# Altium project MZCAT_motherboard_RPI.PrjPcb (part 1 of 2)
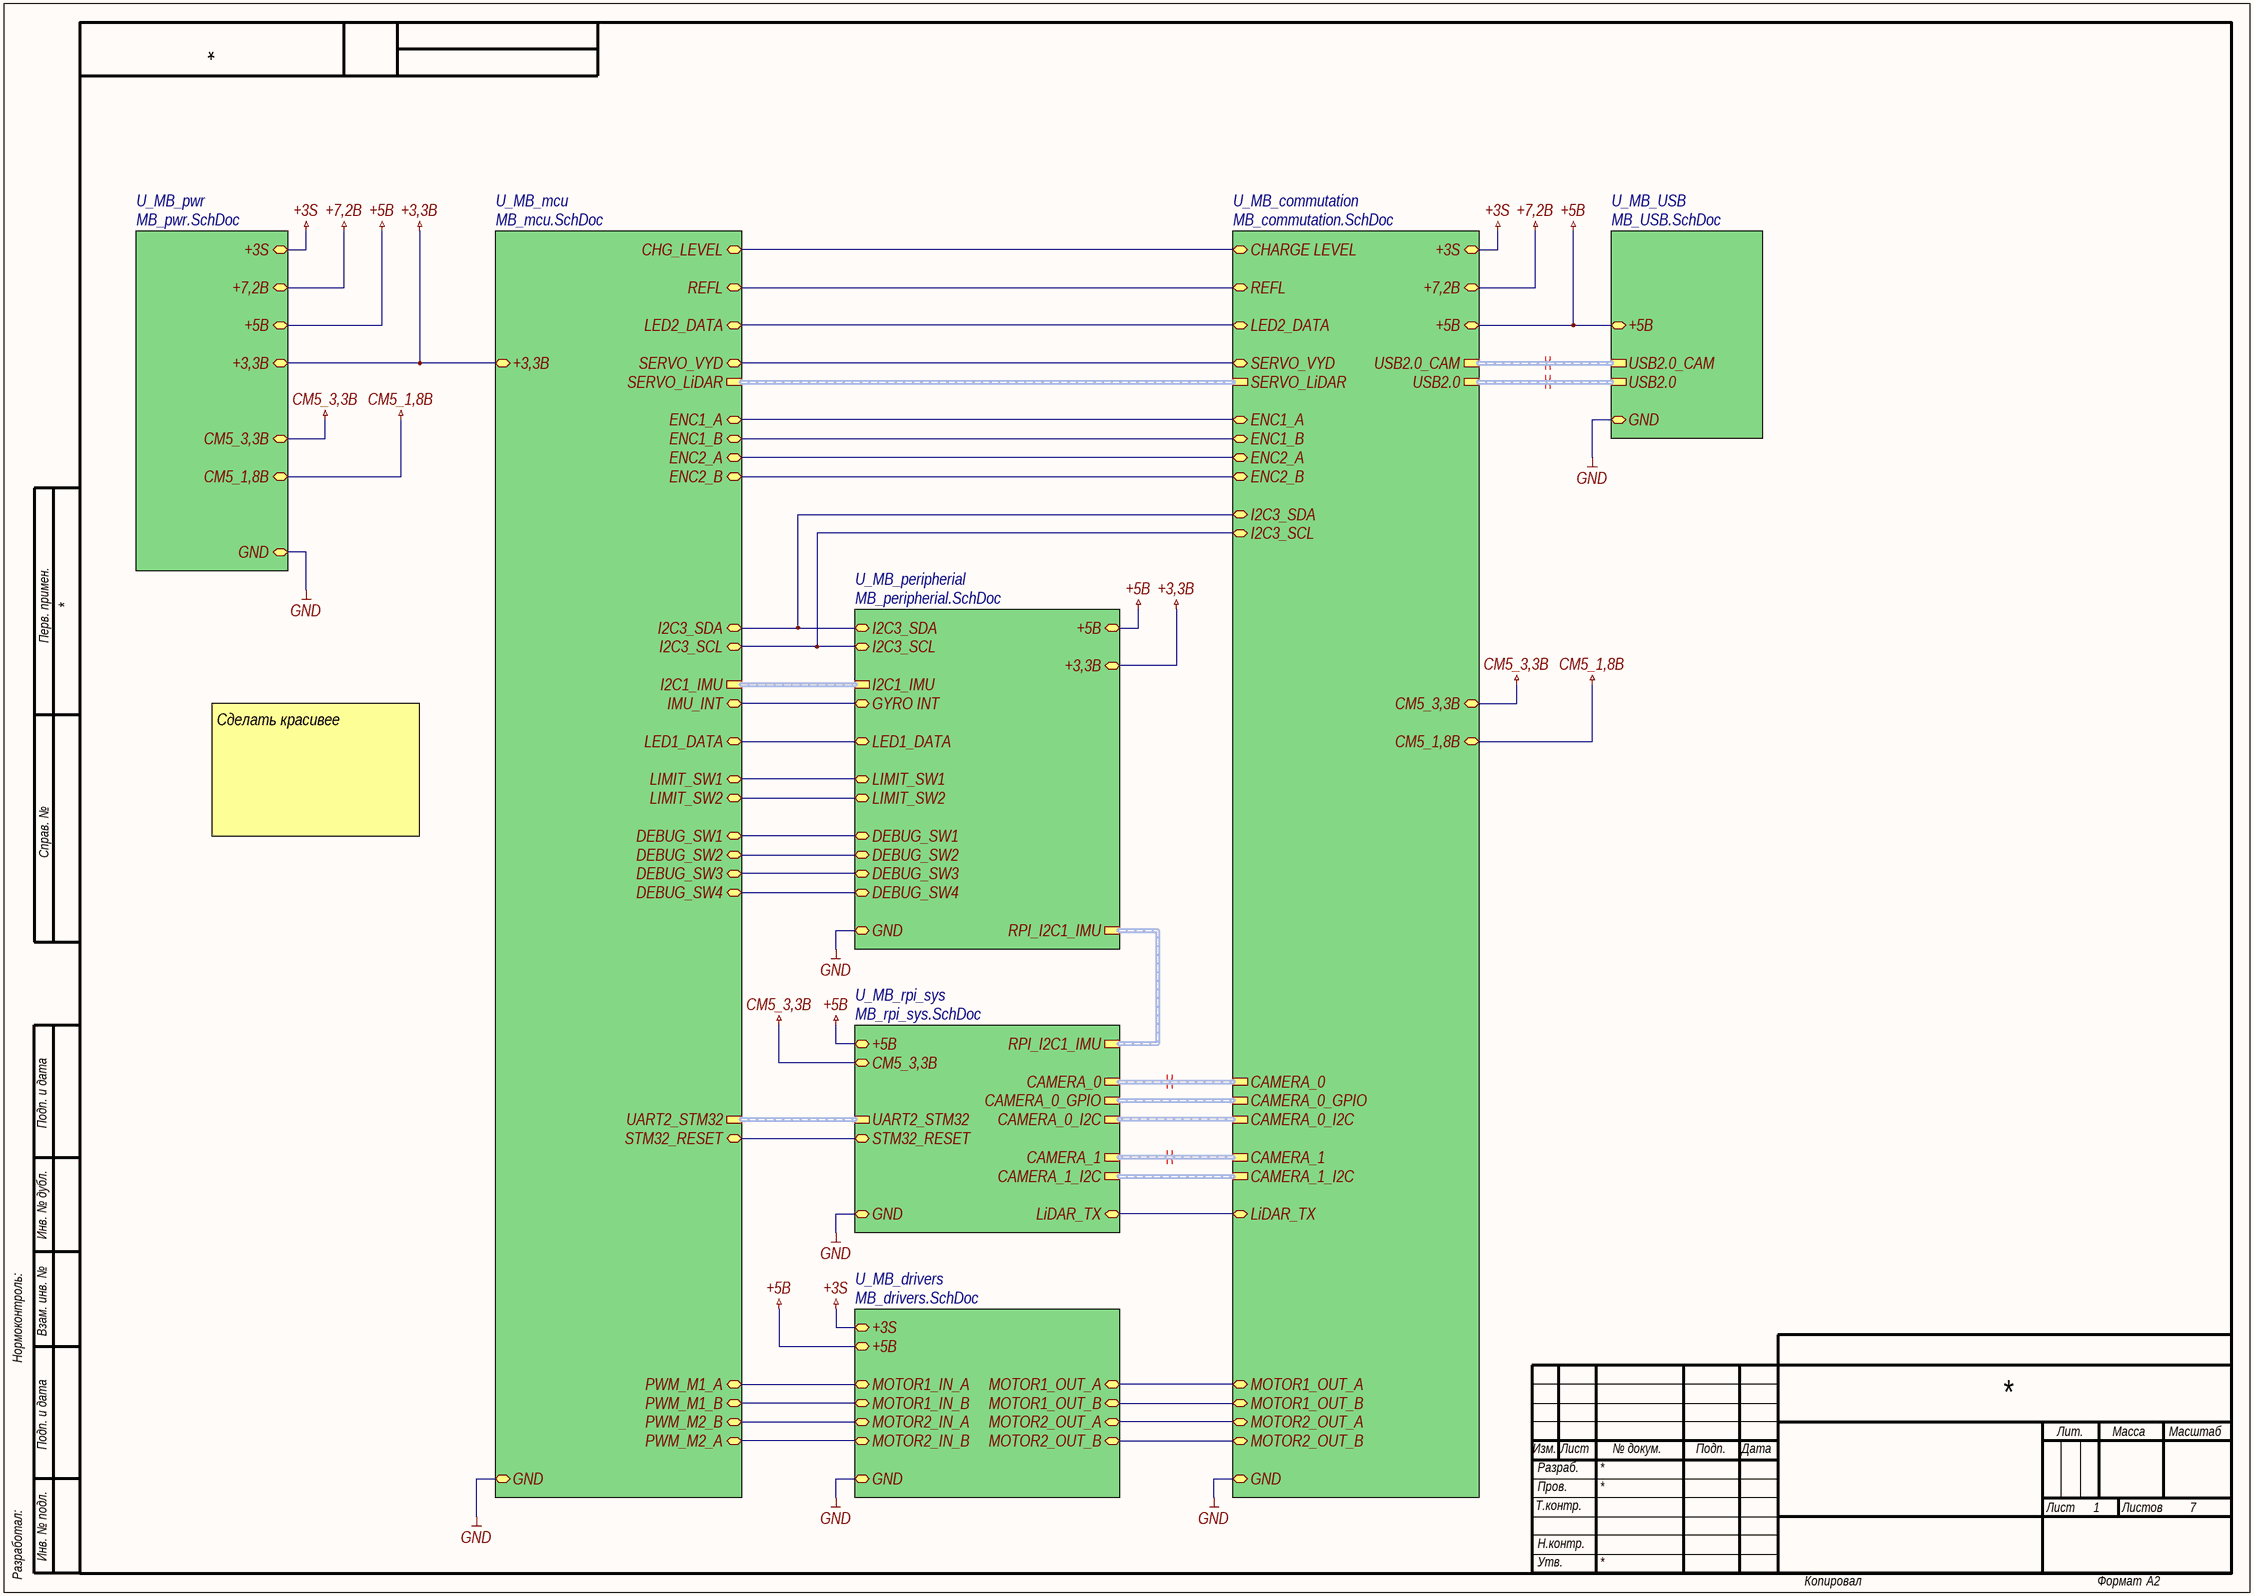
[diagram p0: MB_main.SchDoc]
8 sheets, 289 parts. Net scope: strictly hierarchical (ports join the sheet entries above them; power ports are local).
Board file: MZCAT_motherboard.PcbDoc
Sheets:
  MB_main.SchDoc
    U_MB_pwr = MB_pwr.SchDoc
    U_MB_mcu = MB_mcu.SchDoc
    U_MB_USB = MB_USB.SchDoc
    U_MB_rpi_sys = MB_rpi_sys.SchDoc
    U_MB_peripherial = MB_peripherial.SchDoc
    U_MB_drivers = MB_drivers.SchDoc
    U_MB_commutation = MB_commutation.SchDoc

## Sheet MB_main.SchDoc
size 594 x 420 mm; SheetNumber: 1; SheetTotal: 7

### Sub-sheets
U_MB_commutation = MB_commutation.SchDoc: +5В (bidir), GND (bidir), +3S (bidir), LED2_DATA (bidir), LiDAR_TX (bidir), CHARGE LEVEL (bidir), I2C3_SCL (bidir), I2C3_SDA (bidir), MOTOR2_OUT_B (bidir), MOTOR2_OUT_A (bidir), MOTOR1_OUT_A (bidir), MOTOR1_OUT_B (bidir), ENC1_A (bidir), ENC1_B (bidir), ENC2_A (bidir), ENC2_B (bidir), CAMERA_1 (harness MIPI CSI1), CAMERA_0 (harness MIPI CSI0), SERVO_LiDAR (harness IMU  LiDAR STB), CM5_3,3В (bidir), CM5_1,8В (bidir), SERVO_VYD (bidir), REFL (bidir), CAMERA_0_GPIO (harness CSI0_GPIO), CAMERA_0_I2C (harness CSI0_I2C), CAMERA_1_I2C (harness CSI1_I2C), +7,2В (bidir), USB2.0_CAM (harness USB2.0_CAM), USB2.0 (harness USB2.0)
U_MB_drivers = MB_drivers.SchDoc: MOTOR2_OUT_B (bidir), MOTOR2_OUT_A (bidir), MOTOR2_IN_A (bidir), MOTOR2_IN_B (bidir), MOTOR1_OUT_A (bidir), MOTOR1_OUT_B (bidir), MOTOR1_IN_A (bidir), MOTOR1_IN_B (bidir), +5В (bidir), GND (bidir), +3S (bidir)
U_MB_mcu = MB_mcu.SchDoc: +3,3В (bidir), GND (bidir), I2C3_SDA (bidir), I2C3_SCL (bidir), SERVO_VYD (bidir), PWM_M1_B (bidir), PWM_M2_B (bidir), PWM_M2_A (bidir), ENC1_A (bidir), ENC1_B (bidir), ENC2_B (bidir), LED1_DATA (bidir), LED2_DATA (bidir), LIMIT_SW1 (bidir), LIMIT_SW2 (bidir), DEBUG_SW1 (bidir), DEBUG_SW2 (bidir), DEBUG_SW3 (bidir), I2C1_IMU (harness IMU I2C), REFL (bidir), DEBUG_SW4 (bidir), SERVO_LiDAR (harness IMU  LiDAR STB), ENC2_A (bidir), PWM_M1_A (bidir), IMU_INT (bidir), CHG_LEVEL (bidir), STM32_RESET (bidir), UART2_STM32 (harness USART)
U_MB_peripherial = MB_peripherial.SchDoc: LED1_DATA (bidir), I2C3_SCL (bidir), I2C3_SDA (bidir), I2C1_IMU (harness IMU I2C), +3,3В (bidir), GND (bidir), +5В (bidir), GYRO INT (bidir), LIMIT_SW1 (bidir), LIMIT_SW2 (bidir), DEBUG_SW1 (bidir), DEBUG_SW2 (bidir), DEBUG_SW3 (bidir), DEBUG_SW4 (bidir), RPI_I2C1_IMU (harness IMU)
U_MB_pwr = MB_pwr.SchDoc: +3,3В (bidir), GND (bidir), +5В (bidir), +7,2В (bidir), +3S (bidir), CM5_3,3В (bidir), CM5_1,8В (bidir)
U_MB_rpi_sys = MB_rpi_sys.SchDoc: +5В (bidir), GND (bidir), LiDAR_TX (bidir), CAMERA_1 (harness MIPI CSI1), CAMERA_0 (harness MIPI CSI0), CM5_3,3В (bidir), CAMERA_0_GPIO (harness CSI0_GPIO), CAMERA_0_I2C (harness CSI0_I2C), CAMERA_1_I2C (harness CSI1_I2C), STM32_RESET (bidir), UART2_STM32 (harness USART), RPI_I2C1_IMU (harness IMU)
U_MB_USB = MB_USB.SchDoc: +5В (bidir), GND (bidir), USB2.0_CAM (harness USB2.0_CAM), USB2.0 (harness USB2.0)

### Nets
+3,3В: sheet U_MB_pwr/+3,3В, sheet U_MB_mcu/+3,3В, sheet U_MB_peripherial/+3,3В
+3S: sheet U_MB_pwr/+3S, sheet U_MB_drivers/+3S, sheet U_MB_commutation/+3S
+5В: sheet U_MB_pwr/+5В, sheet U_MB_USB/+5В, sheet U_MB_rpi_sys/+5В, sheet U_MB_peripherial/+5В, sheet U_MB_drivers/+5В, sheet U_MB_commutation/+5В
+7,2В: sheet U_MB_pwr/+7,2В, sheet U_MB_commutation/+7,2В
CM5_1,8В: sheet U_MB_pwr/CM5_1,8В, sheet U_MB_commutation/CM5_1,8В
CM5_3,3В: sheet U_MB_pwr/CM5_3,3В, sheet U_MB_rpi_sys/CM5_3,3В, sheet U_MB_commutation/CM5_3,3В
GND: sheet U_MB_pwr/GND, sheet U_MB_mcu/GND, sheet U_MB_USB/GND, sheet U_MB_rpi_sys/GND, sheet U_MB_peripherial/GND, sheet U_MB_drivers/GND, sheet U_MB_commutation/GND
CHARGE LEVEL: sheet U_MB_mcu/CHG_LEVEL, sheet U_MB_commutation/CHARGE LEVEL
DEBUG_SW1: sheet U_MB_mcu/DEBUG_SW1, sheet U_MB_peripherial/DEBUG_SW1
DEBUG_SW2: sheet U_MB_mcu/DEBUG_SW2, sheet U_MB_peripherial/DEBUG_SW2
DEBUG_SW3: sheet U_MB_mcu/DEBUG_SW3, sheet U_MB_peripherial/DEBUG_SW3
DEBUG_SW4: sheet U_MB_mcu/DEBUG_SW4, sheet U_MB_peripherial/DEBUG_SW4
ENC1_A: sheet U_MB_mcu/ENC1_A, sheet U_MB_commutation/ENC1_A
ENC1_B: sheet U_MB_mcu/ENC1_B, sheet U_MB_commutation/ENC1_B
ENC2_A: sheet U_MB_mcu/ENC2_A, sheet U_MB_commutation/ENC2_A
ENC2_B: sheet U_MB_mcu/ENC2_B, sheet U_MB_commutation/ENC2_B
GYRO INT: sheet U_MB_mcu/IMU_INT, sheet U_MB_peripherial/GYRO INT
I2C3_SCL: sheet U_MB_mcu/I2C3_SCL, sheet U_MB_peripherial/I2C3_SCL, sheet U_MB_commutation/I2C3_SCL
I2C3_SDA: sheet U_MB_mcu/I2C3_SDA, sheet U_MB_peripherial/I2C3_SDA, sheet U_MB_commutation/I2C3_SDA
LED1_DATA: sheet U_MB_mcu/LED1_DATA, sheet U_MB_peripherial/LED1_DATA
LED2_DATA: sheet U_MB_mcu/LED2_DATA, sheet U_MB_commutation/LED2_DATA
LiDAR_TX: sheet U_MB_rpi_sys/LiDAR_TX, sheet U_MB_commutation/LiDAR_TX
LIMIT_SW1: sheet U_MB_mcu/LIMIT_SW1, sheet U_MB_peripherial/LIMIT_SW1
LIMIT_SW2: sheet U_MB_mcu/LIMIT_SW2, sheet U_MB_peripherial/LIMIT_SW2
MOTOR1_IN_A: sheet U_MB_mcu/PWM_M1_A, sheet U_MB_drivers/MOTOR1_IN_A
MOTOR1_IN_B: sheet U_MB_mcu/PWM_M1_B, sheet U_MB_drivers/MOTOR1_IN_B
MOTOR1A_OUT: sheet U_MB_drivers/MOTOR1_OUT_A, sheet U_MB_commutation/MOTOR1_OUT_A
MOTOR1B_OUT: sheet U_MB_drivers/MOTOR1_OUT_B, sheet U_MB_commutation/MOTOR1_OUT_B
MOTOR2_IN_A: sheet U_MB_mcu/PWM_M2_B, sheet U_MB_drivers/MOTOR2_IN_A
MOTOR2_IN_B: sheet U_MB_mcu/PWM_M2_A, sheet U_MB_drivers/MOTOR2_IN_B
MOTOR2A_OUT: sheet U_MB_drivers/MOTOR2_OUT_A, sheet U_MB_commutation/MOTOR2_OUT_A
MOTOR2B_OUT: sheet U_MB_drivers/MOTOR2_OUT_B, sheet U_MB_commutation/MOTOR2_OUT_B
REFL: sheet U_MB_mcu/REFL, sheet U_MB_commutation/REFL
SERVO_VYD: sheet U_MB_mcu/SERVO_VYD, sheet U_MB_commutation/SERVO_VYD
STM32_RESET: sheet U_MB_mcu/STM32_RESET, sheet U_MB_rpi_sys/STM32_RESET

### Buses and harness runs
harness sheet U_MB_commutation/CAMERA_0 = sheet U_MB_rpi_sys/CAMERA_0
harness sheet U_MB_commutation/CAMERA_0_GPIO = sheet U_MB_rpi_sys/CAMERA_0_GPIO
harness sheet U_MB_commutation/CAMERA_0_I2C = sheet U_MB_rpi_sys/CAMERA_0_I2C
harness sheet U_MB_commutation/CAMERA_1 = sheet U_MB_rpi_sys/CAMERA_1
harness sheet U_MB_commutation/CAMERA_1_I2C = sheet U_MB_rpi_sys/CAMERA_1_I2C
harness sheet U_MB_commutation/SERVO_LiDAR = sheet U_MB_mcu/SERVO_LiDAR
harness sheet U_MB_commutation/USB2.0 = sheet U_MB_USB/USB2.0
harness sheet U_MB_commutation/USB2.0_CAM = sheet U_MB_USB/USB2.0_CAM
harness sheet U_MB_mcu/I2C1_IMU = sheet U_MB_peripherial/I2C1_IMU
harness sheet U_MB_mcu/UART2_STM32 = sheet U_MB_rpi_sys/UART2_STM32
harness sheet U_MB_peripherial/RPI_I2C1_IMU = sheet U_MB_rpi_sys/RPI_I2C1_IMU

### Layout directives
differential pair; rule Differential Pairs Routing [Pref Gap = 0.3mm    Min Gap  = 0.3mm    Max Gap  = 0.3mmPref Width = 0.184mm    Min Width  = 0.184mm    Max Width  = 0.184mm]; rule Matched Net Lengths [Tolerance = 1.5mm]; rule Matched Net Lengths [Tolerance = 0.15mm]; differential pair class CAM_0; net class CAM_0: (no net found under the mark)
differential pair; rule Differential Pairs Routing [Pref Gap = 0.3mm    Min Gap  = 0.3mm    Max Gap  = 0.3mmPref Width = 0.184mm    Min Width  = 0.184mm    Max Width  = 0.184mm]; rule Matched Net Lengths [Tolerance = 1.5mm]; rule Matched Net Lengths [Tolerance = 0.15mm]; differential pair class CAM_1; net class CAM_1: (no net found under the mark)
differential pair; rule Differential Pairs Routing [Pref Gap = 0.3mm    Min Gap  = 0.3mm    Max Gap  = 0.3mmPref Width = 0.184mm    Min Width  = 0.184mm    Max Width  = 0.184mm]; rule Matched Net Lengths [Tolerance = 1.5mm]; rule Matched Net Lengths [Tolerance = 0.15mm]; differential pair class USB_2.0; net class USB_2.0: (no net found under the mark)
differential pair; rule Differential Pairs Routing [Pref Gap = 0.3mm    Min Gap  = 0.3mm    Max Gap  = 0.3mmPref Width = 0.184mm    Min Width  = 0.184mm    Max Width  = 0.184mm]; rule Matched Net Lengths [Tolerance = 1.5mm]; rule Matched Net Lengths [Tolerance = 0.15mm]; differential pair class USB_2.0_CAM; net class USB_2.0_CAM: (no net found under the mark)

### Notes on the sheet
- Сделать красивее
- Перв. примен.
- Справ. №
- Подп. и дата
- Инв. № дубл.
- Нормоконтроль:
- Взам. инв. №
- Изм.
- Лист
- № докум.
- Подп.
- Дата
- Лит.
- Масса
- Масштаб
- Т.контр.
- Пров.
- Разраб.
- Листов
- Разработал:
- Инв. № подл.
- Н.контр.
- Утв.
- Копировал
- Формат
- А2

## Sheet MB_pwr.SchDoc
size 840 x 594 mm; SheetNumber: 5; SheetTotal: 8
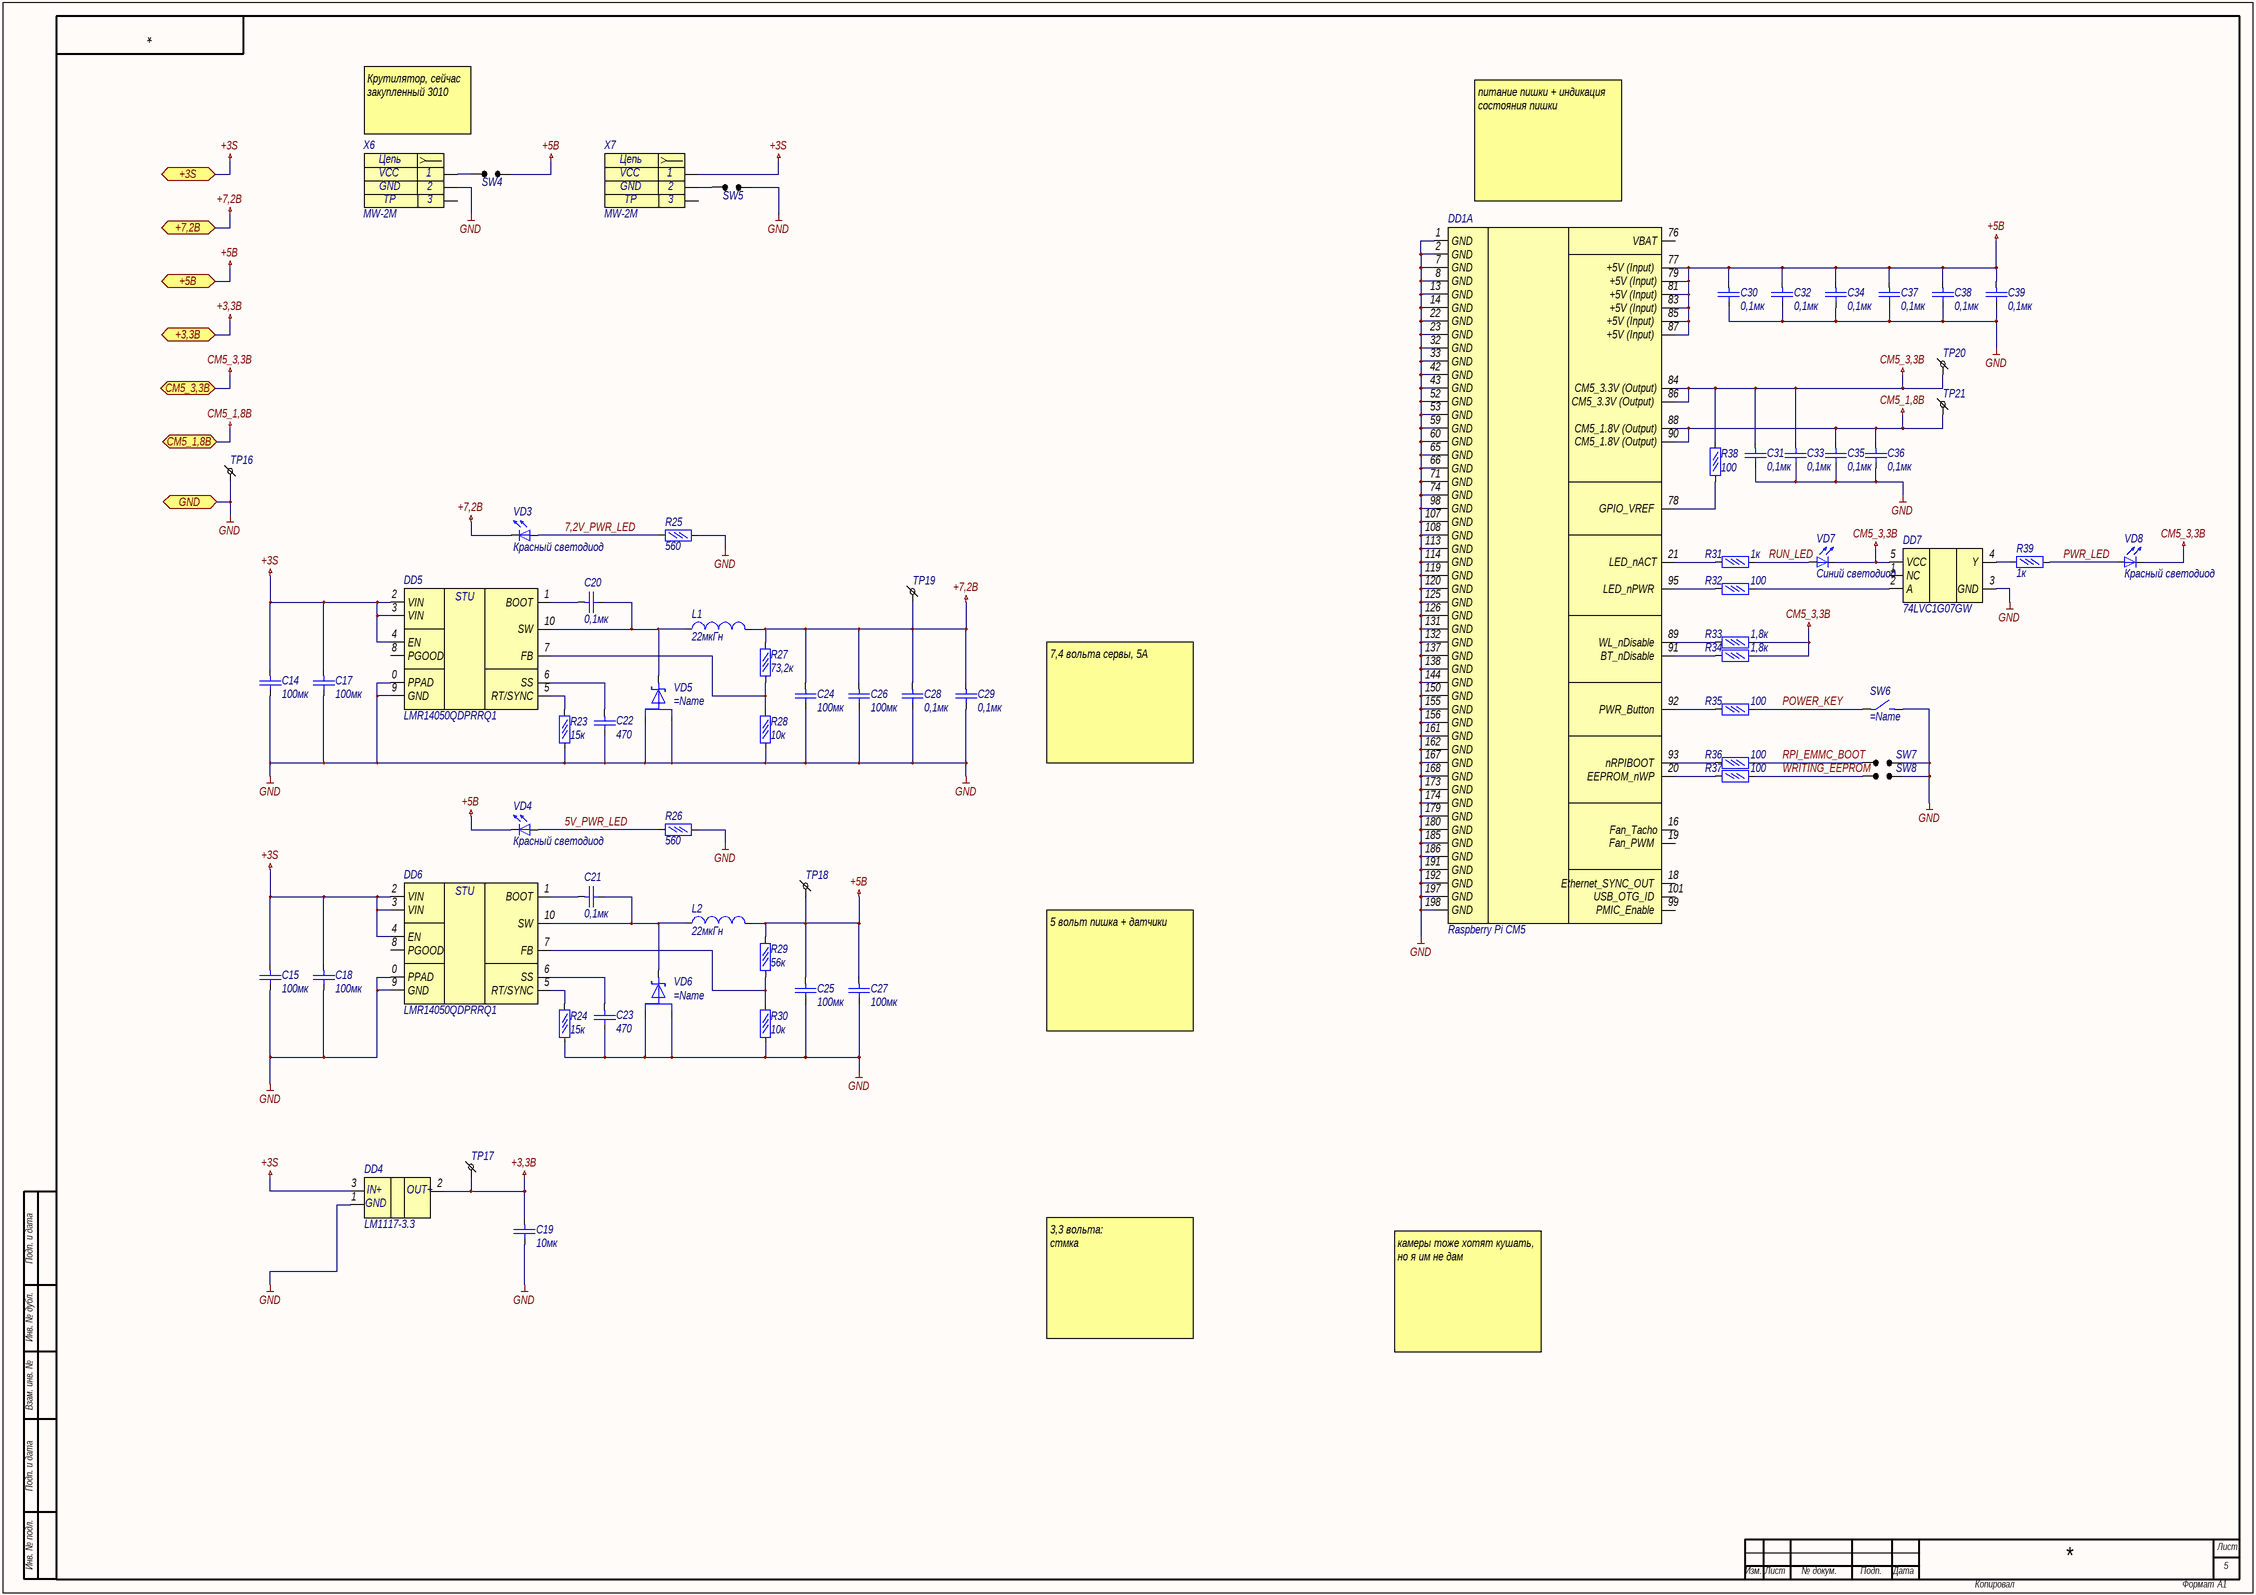
[diagram p1: MB_pwr.SchDoc]

### Parts
DD1  Raspberry Pi CM5  [raspberry_pi_compute_module_4_header]  (part A of 6)
DD4  LM1117-3.3  [SOT-223]
DD5  LMR14050QDPRRQ1  [WSON-10]
DD6  LMR14050QDPRRQ1  [WSON-10]
DD7  74LVC1G07GW  [SOT353]
L1  22мкГн  [SRP1038A]
L2  22мкГн  [SRP1038A]
R23  15к  [R0402]
R24  15к  [R0402]
R25  560  [R0402]
R26  560  [R0402]
R27  73,2к  [R0402]
R28  10к  [R0402]
R29  56к  [R0402]
R30  10к  [R0402]
R31  1к  [R0402]
R32  100  [R0402]
R33  1,8к  [R0402]
R34  1,8к  [R0402]
R35  100  [R0402]
R36  100  [R0402]
R37  100  [R0402]
R38  100  [R0402]
R39  1к  [R0402]
SW4  (no value)  [PLD 1.27X2]
SW5  (no value)  [PLD 1.27X2]
SW6  (no value)  [it-1187]
SW7  (no value)  [PLD 1.27X2]
SW8  (no value)  [PLD 1.27X2]
TP16  TestPoint  [0.5 x 0,9_round]  (value not drawn)
TP17  TestPoint  [0.5 x 0,9_round]  (value not drawn)
TP18  TestPoint  [0.5 x 0,9_round]  (value not drawn)
TP19  TestPoint  [0.5 x 0,9_round]  (value not drawn)
TP20  TestPoint  [0.5 x 0,9_round]  (value not drawn)
TP21  TestPoint  [0.5 x 0,9_round]  (value not drawn)
VD3  Красный светодиод  [0603 - led]
VD4  Красный светодиод  [0603 - led]
VD5  (no value)  [TO-277A]
VD6  (no value)  [TO-277A]
VD7  Синий светодиод  [0603 - led - no point]
VD8  Красный светодиод  [0603 - led - no point]
X6  MW-2M  [DS1020-02-02MVT1R]
X7  MW-2M  [MW-2M]
С14  100мк  [C1210_AA - 2.5]
С15  100мк  [C1210_AA - 2.5]
С17  100мк  [C1210_AA - 2.5]
С18  100мк  [C1210_AA - 2.5]
С19  10мк  [C0603]
С20  0,1мк  [C0402]
С21  0,1мк  [C0402]
С22  470  [C0402]
С23  470  [C0402]
С24  100мк  [C1210_AA - 2.5]
С25  100мк  [C1210_AA - 2.5]
С26  100мк  [C1210_AA - 2.5]
С27  100мк  [C1210_AA - 2.5]
С28  0,1мк  [C0402]
С29  0,1мк  [C0402]
С30  0,1мк  [C0402]
С31  0,1мк  [C0402]
С32  0,1мк  [C0402]
С33  0,1мк  [C0402]
С34  0,1мк  [C0402]
С35  0,1мк  [C0402]
С36  0,1мк  [C0402]
С37  0,1мк  [C0402]
С38  0,1мк  [C0402]
С39  0,1мк  [C0402]

### Ports
+3,3В (bidir), +3S (bidir), +5В (bidir), +7,2В (bidir), CM5_1,8В (bidir), CM5_3,3В (bidir), GND (bidir)

### Nets
+3,3В: DD4.2 TP17.1 С19.2 ; port +3,3В
+3S: DD4.3 DD5.2(VIN) DD5.3(VIN) DD5.4(EN) DD6.2(VIN) DD6.3(VIN) DD6.4(EN) X7.1 С14.2 С15.2 С17.2 С18.2 ; port +3S
+5В: DD1.77(+5V_(Input)) DD1.79(+5V_(Input)) DD1.81(+5V_(Input)) DD1.83(+5V_(Input)) DD1.85(+5V_(Input)) DD1.87(+5V_(Input)) L2.1 R29.2 SW4.2 TP18.1 VD4.2(K) С25.2 С27.2 С30.2 С32.2 С34.2 С37.2 С38.2 С39.2 ; port +5В
+7,2В: L1.1 R27.2 TP19.1 VD3.2(K) С24.2 С26.2 С28.2 С29.2 ; port +7,2В
CM5_1,8В: DD1.88(CM5_1.8V_(Output)) DD1.90(CM5_1.8V_(Output)) TP21.1 С35.2 С36.2 ; port CM5_1,8В
CM5_3,3В: DD1.84(CM5_3.3V_(Output)) DD1.86(CM5_3.3V_(Output)) DD7.5(VCC) R33.2 R34.2 R38.2 TP20.1 VD7.2(K) VD8.2(K) С31.2 С33.2 ; port CM5_3,3В
GND: DD1.1(GND) DD1.2(GND) DD1.7(GND) DD1.8(GND) DD1.13(GND) DD1.14(GND) DD1.22(GND) DD1.23(GND) DD1.32(GND) DD1.33(GND) DD1.42(GND) DD1.43(GND) DD1.52(GND) DD1.53(GND) DD1.59(GND) DD1.60(GND) DD1.65(GND) DD1.66(GND) DD1.71(GND) DD1.74(GND) DD1.98(GND) DD1.107(GND) DD1.108(GND) DD1.113(GND) DD1.114(GND) DD1.119(GND) DD1.120(GND) DD1.125(GND) DD1.126(GND) DD1.131(GND) DD1.132(GND) DD1.137(GND) DD1.138(GND) DD1.144(GND) DD1.150(GND) DD1.155(GND) DD1.156(GND) DD1.161(GND) DD1.162(GND) DD1.167(GND) DD1.168(GND) DD1.173(GND) DD1.174(GND) DD1.179(GND) DD1.180(GND) DD1.185(GND) DD1.186(GND) DD1.191(GND) DD1.192(GND) DD1.197(GND) DD1.198(GND) DD4.1 DD5.0(PPAD) DD5.9(GND) DD6.0(PPAD) DD6.9(GND) DD7.3(GND) R23.1 R24.1 R25.2 R26.2 R28.1 R30.1 SW5.2 SW6.2 SW7.2 SW8.2 TP16.1 VD5.1(A) VD5.2(A) VD6.1(A) VD6.2(A) X6.2 С14.1 С15.1 С17.1 С18.1 С19.1 С22.1 С23.1 С24.1 С25.1 С26.1 С27.1 С28.1 С29.1 С30.1 С31.1 С32.1 С33.1 С34.1 С35.1 С36.1 С37.1 С38.1 С39.1 ; port GND
5V_PWR_LED: R26.1 VD4.1(A)  [project net 5V_PWR_LED_5]
7,2V_PWR_LED: R25.1 VD3.1(A)  [project net 7,2V_PWR_LED_5]
POWER_KEY: R35.2 SW6.1  [project net POWER_KEY_5]
PWR_LED: R39.2 VD8.1(A)  [project net PWR_LED_5]
RPI_EMMC_BOOT: R36.2 SW7.1  [project net RPI_EMMC_BOOT_5]
RUN_LED: R31.2 VD7.1(A)  [project net RUN_LED_5]
WRITING_EEPROM: R37.2 SW8.1  [project net WRITING_EEPROM_5]
NetDD1_20: DD1.20(EEPROM_nWP) R37.1
NetDD1_21: DD1.21(LED_nACT) R31.1
NetDD1_78: DD1.78(GPIO_VREF) R38.1
NetDD1_89: DD1.89(WL_nDisable) R33.1
NetDD1_91: DD1.91(BT_nDisable) R34.1
NetDD1_92: DD1.92(PWR_Button) R35.1
NetDD1_93: DD1.93(nRPIBOOT) R36.1
NetDD1_95: DD1.95(LED_nPWR) R32.1
NetDD5_1: DD5.1(BOOT) С20.2
NetDD5_5: DD5.5(RT/SYNC) R23.2
NetDD5_6: DD5.6(SS) С22.2
NetDD5_7: DD5.7(FB) R27.1 R28.2
NetDD5_10: DD5.10(SW) L1.2 VD5.3(K) С20.1
NetDD6_1: DD6.1(BOOT) С21.2
NetDD6_5: DD6.5(RT/SYNC) R24.2
NetDD6_6: DD6.6(SS) С23.2
NetDD6_7: DD6.7(FB) R29.1 R30.2
NetDD6_10: DD6.10(SW) L2.2 VD6.3(K) С21.1
NetDD7_2: DD7.2(A) R32.2
NetDD7_4: DD7.4(Y) R39.1
NetSW4_1: SW4.1 X6.1
NetSW5_1: SW5.1 X7.2

Not connected (* = marked no-connect by the designer): DD1 16(Fan_Tacho) 18(Ethernet_SYNC_OUT_) 19(Fan_PWM_) 76(VBAT) 99(PMIC_Enable_) 101(USB_OTG_ID_); DD5 8(PGOOD); DD6 8(PGOOD); DD7 1(NC); X6 0; X7 0

### Notes on the sheet
- Крутилятор, сейчас закупленный 3010
- питание пишки + индикация состояния пишки
- 7,4 вольта сервы, 5А
- 5 вольт пишка + датчики
- 3,3 вольта:
  стмка
- камеры тоже хотят кушать, но я им не дам
- Подп. и дата
- Инв. № дубл.
- Взам. инв. №
- Инв. № подл.
- Лист
- Изм.
- № докум.
- Подп.
- Дата
- Копировал
- Формат
- А1
- (in symbol Header_2) Цепь; 3
- (in symbol LMR14050QDPRRQ1) STU

### Library data of the parts
DD1 = Raspberry Pi CM5: Raspberry Pi Compute Module 5; Name: Raspberry Pi CM5
DD4 = LM1117-3.3: LM1117GS-3.3; Contact_1: IN+; Contact_2: GND; Contact_3: OUT+; Name: LM1117-3.3
DD5 DD6 = LMR14050QDPRRQ1: Стабилизатор напряжения 5А; Name: LMR14050QDPRRQ1
DD7 = 74LVC1G07GW: буферный элемент с открытым стоком; Name: 74LVC1G07GW
L1 L2 = Индуктивность: Value: 22мкГн
R23-R39 = Резистор 0.05Вт: Резистор 0,05Вт
  R23 R24: Value: 15к
  R25 R26: Value: 560
  R27: Value: 73,2к
  R28 R30: Value: 10к
  R29: Value: 56к
  R31 R39: Value: 1к
  R32 R35-R38: Value: 100
  R33 R34: Value: 1,8к
SW4 SW5 SW7 SW8 = Jumper: Перемычка
SW6 = button
VD3 VD4 VD7 VD8 = SMD светодиод: Светодтод SMD
  VD3 VD4 VD8: Name: Красный светодиод
  VD7: Name: Синий светодиод
VD5 VD6 = SS10PH10: Диод Шоттки
X6 X7 = Header_2: Разъем - 2 конт. розетка; Contact_1: VCC; Contact_2: GND; Contact_3: TP; Name: MW-2M
С14 С15 С17-С39 = Кер. конденсатор
  С14 С15 С17 С18 С24-С27: Value: 100мк
  С19: Value: 10мк
  С20 С21 С28-С39: Value: 0,1мк
  С22 С23: Value: 470

## Sheet MB_mcu.SchDoc
size 594 x 420 mm; SheetNumber: 4; SheetTotal: 8
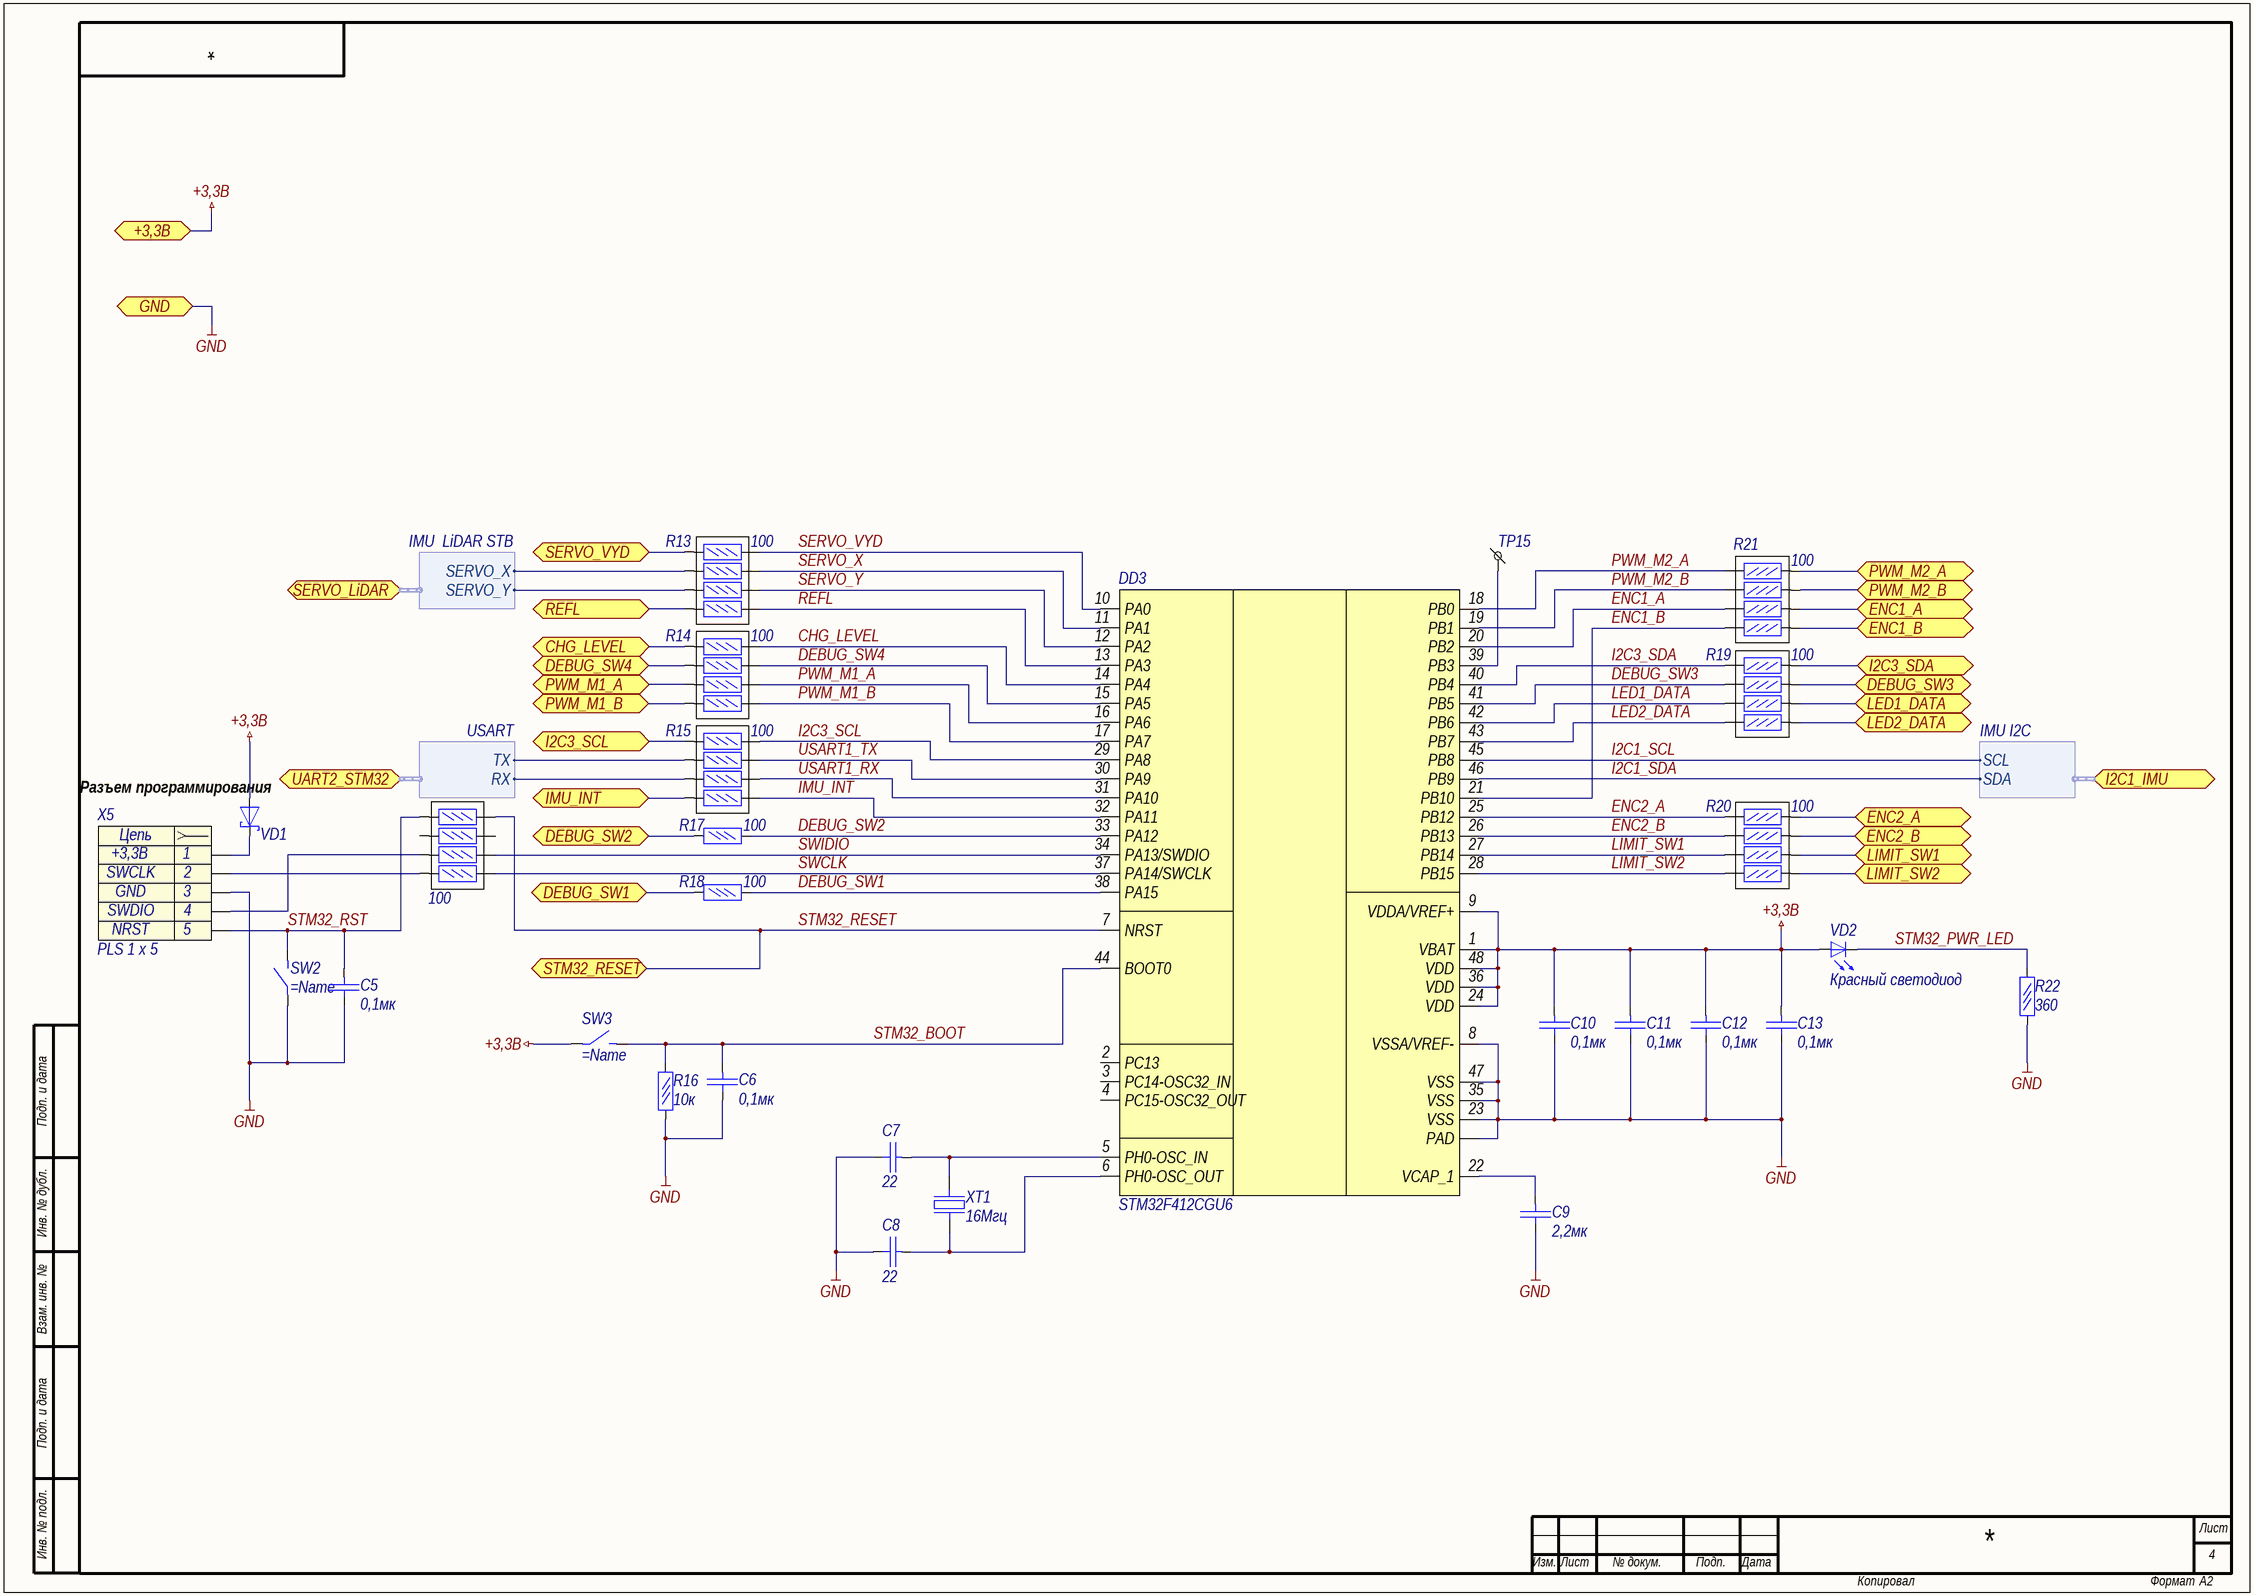
[diagram p2: MB_mcu.SchDoc]

### Parts
DD3  STM32F412CGU6  [UFQFPN48]
R12  100  [R0402x4]
R13  100  [R0402x4]
R14  100  [R0402x4]
R15  100  [R0402x4]
R16  10к  [R0402]
R17  100  [R0402]
R18  100  [R0402]
R19  100  [R0402x4]
R20  100  [R0402x4]
R21  100  [R0402x4]
R22  360  [R0402]
SW2  (no value)  [it-1187]
SW3  (no value)  [OMRON_B3U-1000P]
TP15  TestPoint  [0.5 x 0,9_round]  (value not drawn)
VD1  *  [SOD323]  (value not drawn)
VD2  Красный светодиод  [0603 - led - no point]
X5  PLS 1 x 5  [PLS_1x5 - emty]
XT1  16Мгц  [KX-7]
С5  0,1мк  [C0402]
С6  0,1мк  [C0402]
С7  22  [C0402]
С8  22  [C0402]
С9  2,2мк  [C0402]
С10  0,1мк  [C0402]
С11  0,1мк  [C0402]
С12  0,1мк  [C0402]
С13  0,1мк  [C0402]

### Ports
+3,3В (bidir), CHG_LEVEL (bidir), DEBUG_SW1 (bidir), DEBUG_SW2 (bidir), DEBUG_SW3 (bidir), DEBUG_SW4 (bidir), ENC1_A (bidir), ENC1_B (bidir), ENC2_A (bidir), ENC2_B (bidir), GND (bidir), I2C1_IMU (bidir, harness IMU I2C), I2C3_SCL (bidir), I2C3_SDA (bidir), IMU_INT (bidir), LED1_DATA (bidir), LED2_DATA (bidir), LIMIT_SW1 (bidir), LIMIT_SW2 (bidir), PWM_M1_A (bidir), PWM_M1_B (bidir), PWM_M2_A (bidir), PWM_M2_B (bidir), REFL (bidir), SERVO_LiDAR (bidir, harness IMU  LiDAR STB), SERVO_VYD (bidir), STM32_RESET (bidir), UART2_STM32 (bidir, harness USART)

### Harnesses
IMU I2C: SDA, SCL
USART: RX, TX
IMU  LiDAR STB: SERVO_Y, SERVO_X

### Nets
+3,3В: DD3.1(VBAT) DD3.9(VDDA/VREF+) DD3.24(VDD) DD3.36(VDD) DD3.48(VDD) SW3.1 VD1.2(A) VD2.1(A) С10.2 С11.2 С12.2 С13.2 ; port +3,3В
GND: DD3.8(VSSA/VREF-) DD3.23(VSS) DD3.35(VSS) DD3.47(VSS) DD3.49(PAD) R16.1 R22.2 SW2.1 X5.3 С5.1 С6.1 С7.1 С8.1 С9.1 С10.1 С11.1 С12.1 С13.1 ; port GND
CHARGE LEVEL: R14.1 ; port CHG_LEVEL
CHG_LEVEL: DD3.14(PA4) R14.2  [project net CHG_LEVEL_4]
DEBUG_SW1: R18.1 ; port DEBUG_SW1
DEBUG_SW1: DD3.38(PA15) R18.2  [project net DEBUG_SW1_4]  [a separate net that carries the same name]
DEBUG_SW2: R17.1 ; port DEBUG_SW2
DEBUG_SW2: DD3.33(PA12) R17.2  [project net DEBUG_SW2_4]  [a separate net that carries the same name]
DEBUG_SW3: DD3.41(PB5) R19.4  [project net DEBUG_SW3_4]
DEBUG_SW3: R19.3 ; port DEBUG_SW3  [a separate net that carries the same name]
DEBUG_SW4: DD3.15(PA5) R14.4  [project net DEBUG_SW4_4]
DEBUG_SW4: R14.3 ; port DEBUG_SW4  [a separate net that carries the same name]
ENC1_A: DD3.20(PB2) R21.6  [project net ENC1_A_4]
ENC1_A: R21.5 ; port ENC1_A  [a separate net that carries the same name]
ENC1_B: DD3.21(PB10) R21.8  [project net ENC1_B_4]
ENC1_B: R21.7 ; port ENC1_B  [a separate net that carries the same name]
ENC2_A: DD3.25(PB12) R20.2  [project net ENC2_A_4]
ENC2_A: R20.1 ; port ENC2_A  [a separate net that carries the same name]
ENC2_B: DD3.26(PB13) R20.4  [project net ENC2_B_4]
ENC2_B: R20.3 ; port ENC2_B  [a separate net that carries the same name]
GYRO INT: R15.7 ; port IMU_INT
I2C1_SCL: DD3.45(PB8) ; port I2C1_IMU.SCL
I2C1_SDA: DD3.46(PB9) ; port I2C1_IMU.SDA
I2C3_SCL: DD3.29(PA8) R15.2  [project net I2C3_SCL_4]
I2C3_SCL: R15.1 ; port I2C3_SCL  [a separate net that carries the same name]
I2C3_SDA: DD3.40(PB4) R19.2  [project net I2C3_SDA_4]
I2C3_SDA: R19.1 ; port I2C3_SDA  [a separate net that carries the same name]
IMU_INT: DD3.32(PA11) R15.8  [project net IMU_INT_4]
LED1_DATA: DD3.42(PB6) R19.6  [project net LED1_DATA_4]
LED1_DATA: R19.5 ; port LED1_DATA  [a separate net that carries the same name]
LED2_DATA: DD3.43(PB7) R19.8  [project net LED2_DATA_4]
LED2_DATA: R19.7 ; port LED2_DATA  [a separate net that carries the same name]
LIMIT_SW1: DD3.27(PB14) R20.6  [project net LIMIT_SW1_4]
LIMIT_SW1: R20.5 ; port LIMIT_SW1  [a separate net that carries the same name]
LIMIT_SW2: DD3.28(PB15) R20.8  [project net LIMIT_SW2_4]
LIMIT_SW2: R20.7 ; port LIMIT_SW2  [a separate net that carries the same name]
MOTOR1_IN_A: R14.5 ; port PWM_M1_A
MOTOR1_IN_B: R14.7 ; port PWM_M1_B
MOTOR2_IN_A: R21.3 ; port PWM_M2_B
MOTOR2_IN_B: R21.1 ; port PWM_M2_A
PWM_M1_A: DD3.16(PA6) R14.6  [project net PWM_M1_A_4]
PWM_M1_B: DD3.17(PA7) R14.8  [project net PWM_M1_B_4]
PWM_M2_A: DD3.18(PB0) R21.2  [project net PWM_M2_A_4]
PWM_M2_B: DD3.19(PB1) R21.4  [project net PWM_M2_B_4]
REFL: DD3.13(PA3) R13.8  [project net REFL_4]
REFL: R13.7 ; port REFL  [a separate net that carries the same name]
SERVO_VYD: DD3.10(PA0) R13.2  [project net SERVO_VYD_4]
SERVO_VYD: R13.1 ; port SERVO_VYD  [a separate net that carries the same name]
SERVO_X: DD3.11(PA1) R13.4  [project net SERVO_X_4]
SERVO_Y: DD3.12(PA2) R13.6  [project net SERVO_Y_4]
STM32_BOOT: DD3.44(BOOT0) R16.2 SW3.2 С6.2  [project net STM32_BOOT_4]
STM32_PWR_LED: R22.1 VD2.2(K)  [project net STM32_PWR_LED_4]
STM32_RESET: DD3.7(NRST) R12.2 ; port STM32_RESET
STM32_RST: R12.1 SW2.2 X5.5 С5.2  [project net STM32_RST_4]
SWCLK: DD3.37(PA14/SWCLK) R12.8  [project net SWCLK_4]
SWIDIO: DD3.34(PA13/SWDIO) R12.6  [project net SWIDIO_4]
USART1_RX: DD3.31(PA10) R15.6  [project net USART1_RX_4]
USART1_TX: DD3.30(PA9) R15.4  [project net USART1_TX_4]
NetDD3_5: DD3.5(PH0-OSC_IN) XT1.3 С7.2
NetDD3_6: DD3.6(PH0-OSC_OUT) XT1.1 С8.2
NetDD3_22: DD3.22(VCAP_1) С9.2
NetDD3_39: DD3.39(PB3) TP15.1
NetR1_1: R15.3 ; port UART2_STM32.TX
NetR2_1: R15.5 ; port UART2_STM32.RX
NetR12_5: R12.5 X5.4
NetR12_7: R12.7 X5.2
NetR13_3: R13.3 ; port SERVO_LiDAR.SERVO_X
NetR13_5: R13.5 ; port SERVO_LiDAR.SERVO_Y
NetVD1_1: VD1.1(K) X5.1

Not connected (* = marked no-connect by the designer): DD3 2(PC13) 3(PC14-OSC32_IN) 4(PC15-OSC32_OUT); R12 3 4

### Notes on the sheet
- (near VD1) Разъем программирования
- Подп. и дата
- Инв. № дубл.
- Взам. инв. №
- Инв. № подл.
- Лист
- Изм.
- № докум.
- Подп.
- Дата
- Копировал
- Формат
- А2
- (in symbol PLS 1 x 5) Цепь

### Library data of the parts
DD3 = STM32F412CGU6: микроконтроллер STM32F412, 48-UFQFPN, 100 MHz, 1024kB FLASH, 320kB RAM; Name: STM32F412CGU6
R12-R15 R19-R21 = Резисторная сборка 0.05 x 4: Value: 100
R16-R18 R22 = Резистор 0.05Вт: Резистор 0,05Вт
  R16: Value: 10к
  R17 R18: Value: 100
  R22: Value: 360
SW2 SW3 = button
VD1 = Diode Shottky: Диод Шоттки; Name: *
VD2 = SMD светодиод: Светодтод SMD; Name: Красный светодиод
X5 = PLS 1 x 5: Contact_1: +3,3В; Contact_2: SWCLK; Contact_3: GND; Contact_4: SWDIO; Contact_5: NRST; Name: PLS 1 x 5
XT1 = 12.88605: Резонатор / Geyer; Name: 12.88605; Value: 16Мгц
С5-С13 = Кер. конденсатор
  С5 С6 С10-С13: Value: 0,1мк
  С7 С8: Value: 22
  С9: Value: 2,2мк

## Sheet MB_USB.SchDoc
size 840 x 594 mm; SheetNumber: 2; SheetTotal: 8
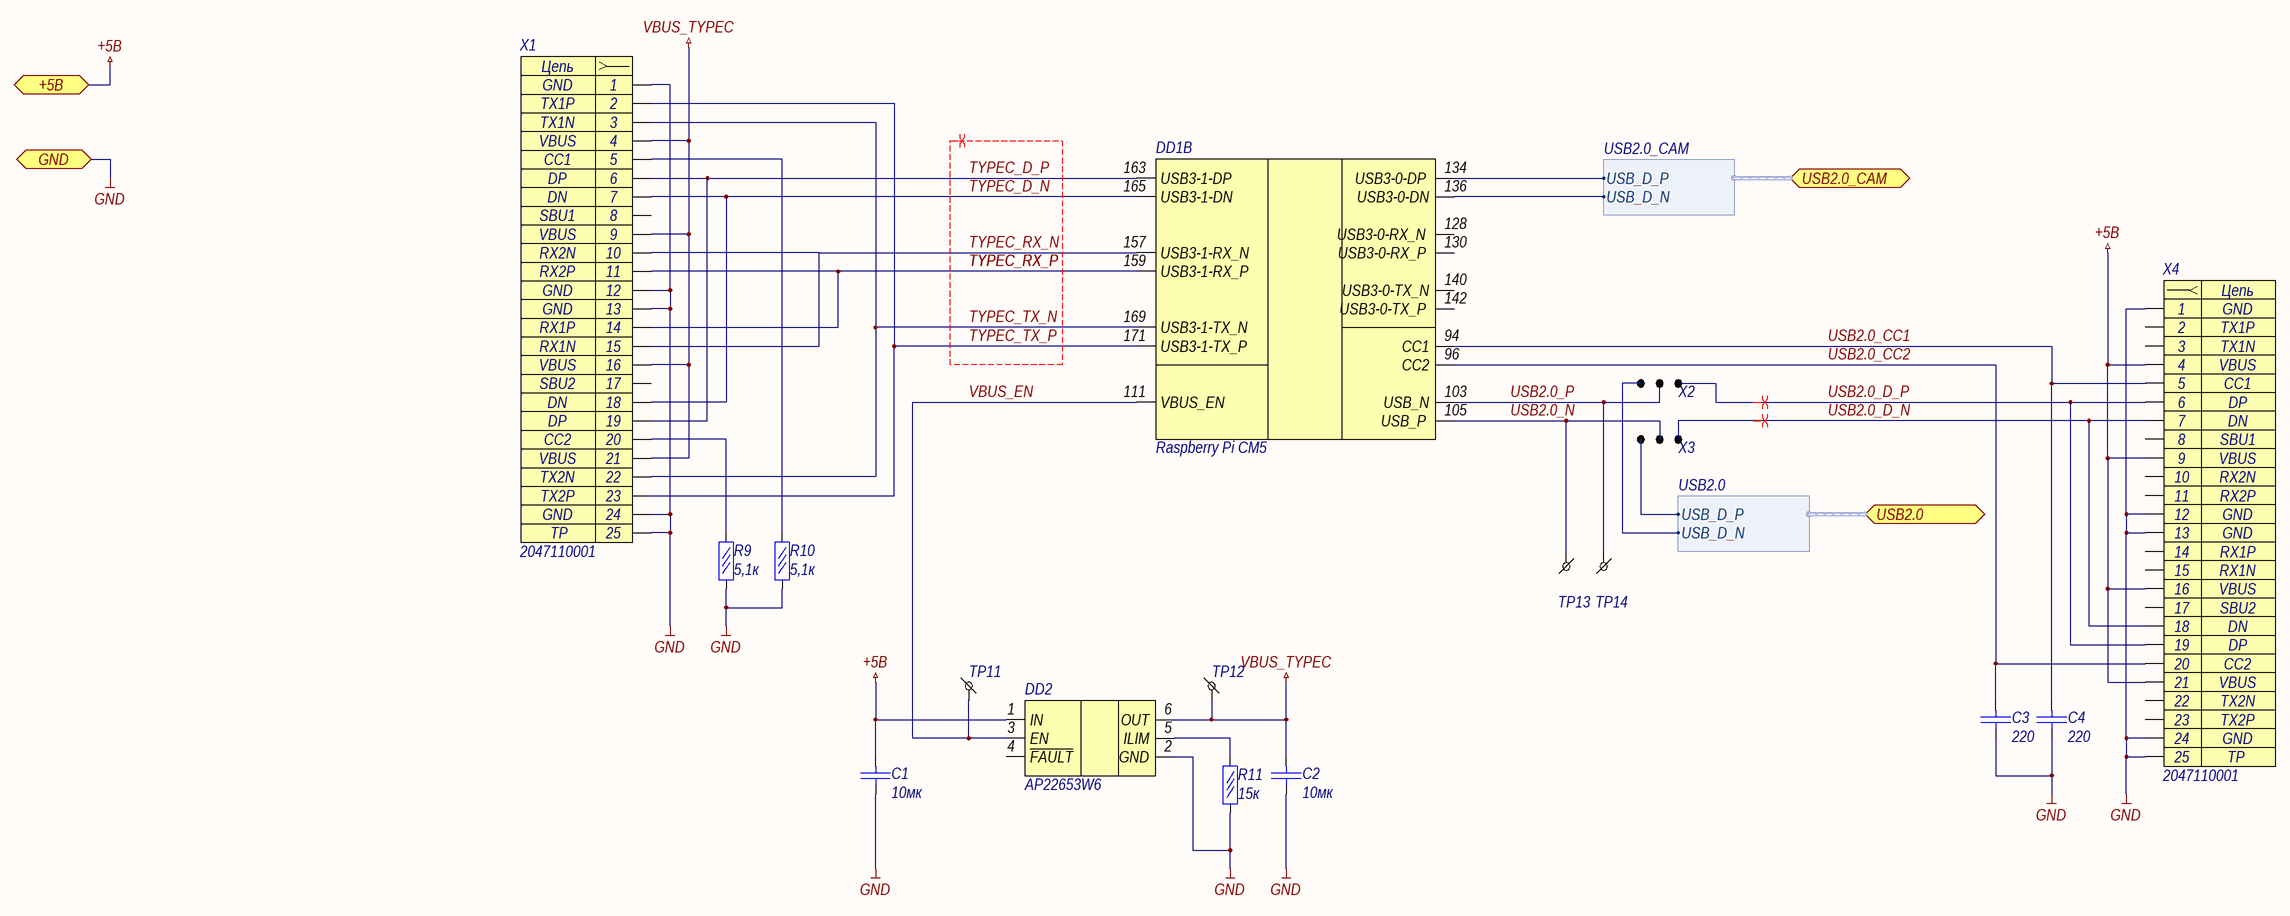
[diagram p3: MB_USB.SchDoc]

### Parts
DD1  Raspberry Pi CM5  [raspberry_pi_compute_module_4_header]  (part B of 6)
DD2  AP22653W6  [SOT23-6]
R9  5,1к  [R0402]
R10  5,1к  [R0402]
R11  15к  [R0402]
TP11  TestPoint  [0.5 x 0,9_round]  (value not drawn)
TP12  TestPoint  [0.5 x 0,9_round]  (value not drawn)
TP13  TestPoint  [0.5 x 0,9_round]  (value not drawn)
TP14  TestPoint  [0.5 x 0,9_round]  (value not drawn)
X1  2047110001  [2047110001]
X2  Jumper_3  [solid_jumper_3]  (value not drawn)  (no BOM)
X3  Jumper_3  [solid_jumper_3]  (value not drawn)  (no BOM)
X4  2047110001  [2047110001]
С1  10мк  [C0603]
С2  10мк  [C0603]
С3  220  [C0402]
С4  220  [C0402]

### Ports
+5В (bidir), GND (bidir), USB2.0 (bidir, harness USB2.0), USB2.0_CAM (bidir, harness USB2.0_CAM)

### Harnesses
USB2.0_CAM: USB_D_N, USB_D_P
USB2.0: USB_D_N, USB_D_P

### Nets
+5В: DD2.1(IN) X4.4(A6) X4.9(GND) X4.16(VCC) X4.21(VCC) С1.2 ; port +5В
GND: DD2.2(GND) R9.1 R10.1 R11.1 X1.1(B8) X1.12(VCC) X1.13(VCC) X1.24(VCC) X1.TP X4.1(B8) X4.12(VCC) X4.13(VCC) X4.24(VCC) X4.TP С1.1 С2.1 С3.1 С4.1 ; port GND
VBUS_TYPEC: DD2.6(OUT) TP12.1 X1.4(A6) X1.9(GND) X1.16(VCC) X1.21(VCC) С2.2
TYPEC_D_N: DD1.165(USB3-1-DN) X1.7(A8) X1.18(VCC)  [project net TYPEC_D_N_2]
TYPEC_D_P: DD1.163(USB3-1-DP) X1.6(B6) X1.19(VCC)  [project net TYPEC_D_P_2]
TYPEC_RX_N: DD1.157(USB3-1-RX_N) X1.10(VCC) X1.15(VCC)  [project net TYPEC_RX_N_2]
TYPEC_RX_P: DD1.159(USB3-1-RX_P) X1.11(VCC) X1.14(VCC)  [project net TYPEC_RX_P_2]
TYPEC_TX_N: DD1.169(USB3-1-TX_N) X1.3(B7) X1.22(VCC)  [project net TYPEC_TX_N_2]
TYPEC_TX_P: DD1.171(USB3-1-TX_P) X1.2(A5) X1.23(VCC)  [project net TYPEC_TX_P_2]
USB2.0_CC1: DD1.94(CC1) X4.5(A7) С4.2  [project net USB2.0_CC1_2]
USB2.0_CC2: DD1.96(CC2) X4.20(VCC) С3.2  [project net USB2.0_CC2_2]
USB2.0_D_N: X3.1 X4.7(A8) X4.18(VCC)  [project net USB2.0_D_N_2]
USB2.0_D_P: X2.1 X4.6(B6) X4.19(VCC)  [project net USB2.0_D_P_2]
USB2.0_N: DD1.105(USB_P) TP13.1 X3.2  [project net USB2.0_N_2]
USB2.0_P: DD1.103(USB_N) TP14.1 X2.2  [project net USB2.0_P_2]
VBUS_EN: DD1.111(VBUS_EN) DD2.3(EN) TP11.1  [project net VBUS_EN_2]
NetDD1_134: DD1.134(USB3-0-DP) ; port USB2.0_CAM.USB_D_P
NetDD1_136: DD1.136(USB3-0-DN) ; port USB2.0_CAM.USB_D_N
NetDD2_5: DD2.5(ILIM) R11.2
NetR9_2: R9.2 X1.20(VCC)
NetR10_2: R10.2 X1.5(A7)
NetR41_2: X2.3 ; port USB2.0.USB_D_N
NetR41_4: X3.3 ; port USB2.0.USB_D_P

Not connected (* = marked no-connect by the designer): DD1 128(USB3-0-RX_N_) 130(USB3-0-RX_P_) 140(USB3-0-TX_N) 142(USB3-0-TX_P_); DD2 4(~{FAULT}); X1 8(B5) 17(VCC); X4 2(A5) 3(B7) 8(B5) 10(VCC) 11(VCC) 14(VCC) 15(VCC) 17(VCC) 22(VCC) 23(VCC)

### Layout directives
differential pair; rule Differential Pairs Routing [Pref Gap = 0.3mm    Min Gap  = 0.3mm    Max Gap  = 0.3mmPref Width = 0.184mm    Min Width  = 0.184mm    Max Width  = 0.184mm]; rule Matched Net Lengths [Tolerance = 1.5mm]; rule Matched Net Lengths [Tolerance = 0.15mm]; differential pair class TypeC; net class TypeC: TYPEC_D_N, TYPEC_D_P, TYPEC_RX_N, TYPEC_RX_P, TYPEC_TX_N, TYPEC_TX_P
differential pair; rule Differential Pairs Routing [Pref Gap = 0.3mm    Min Gap  = 0.3mm    Max Gap  = 0.3mmPref Width = 0.184mm    Min Width  = 0.184mm    Max Width  = 0.184mm]; rule Matched Net Lengths [Tolerance = 1.5mm]; rule Matched Net Lengths [Tolerance = 0.15mm]: USB2.0_D_N_2, USB2.0_D_P_2

### Notes on the sheet
- Подп. и дата
- Инв. № дубл.
- Взам. инв. №
- Инв. № подл.
- Лист
- Изм.
- № докум.
- Подп.
- Дата
- Копировал
- Формат
- А1
- (in symbol 2047110001) Цепь; 25

### Library data of the parts
DD1 = Raspberry Pi CM5: Raspberry Pi Compute Module 5; Name: Raspberry Pi CM5
DD2 = AP22653W6: PRECISION ADJUSTABLE CURRENT-LIMITED POWER SWITCHES; Name: AP22653W6
R9-R11 = Резистор 0.05Вт: Резистор 0,05Вт
  R9 R10: Value: 5,1к
  R11: Value: 15к
X1 X4 = 2047110001: USB Type-C 3.1; Contact_1: GND; Contact_2: TX1P; Contact_3: TX1N; Contact_4: VBUS; Contact_5: CC1; Contact_6: DP; Contact_7: DN; Contact_8: SBU1; Contact_10: RX2N; Contact_11: RX2P; Contact_14: RX1P; Contact_15: RX1N; Contact_17: SBU2; Contact_20: CC2; Contact_22: TX2N; Contact_23: TX2P; Name: 2047110001; Contact_9: VBUS; Contact_12: GND; Contact_13: GND; Contact_16: VBUS; Contact_18: DN; Contact_19: DP; Contact_21: VBUS; Contact_24: GND
X2 X3 = Jumper x3: Перемычка паяльная на плате; ID: 28; Name: SW_Jumper_3_pins; Основной тип: Места под пайку; Доп_Тип: Перемычки; Тип корпуса: 0805; Value: Jumper_3
С1-С4 = Кер. конденсатор
  С1 С2: Value: 10мк
  С3 С4: Value: 220

## Sheet MB_rpi_sys.SchDoc
size 840 x 594 mm; SheetNumber: 3; SheetTotal: 8
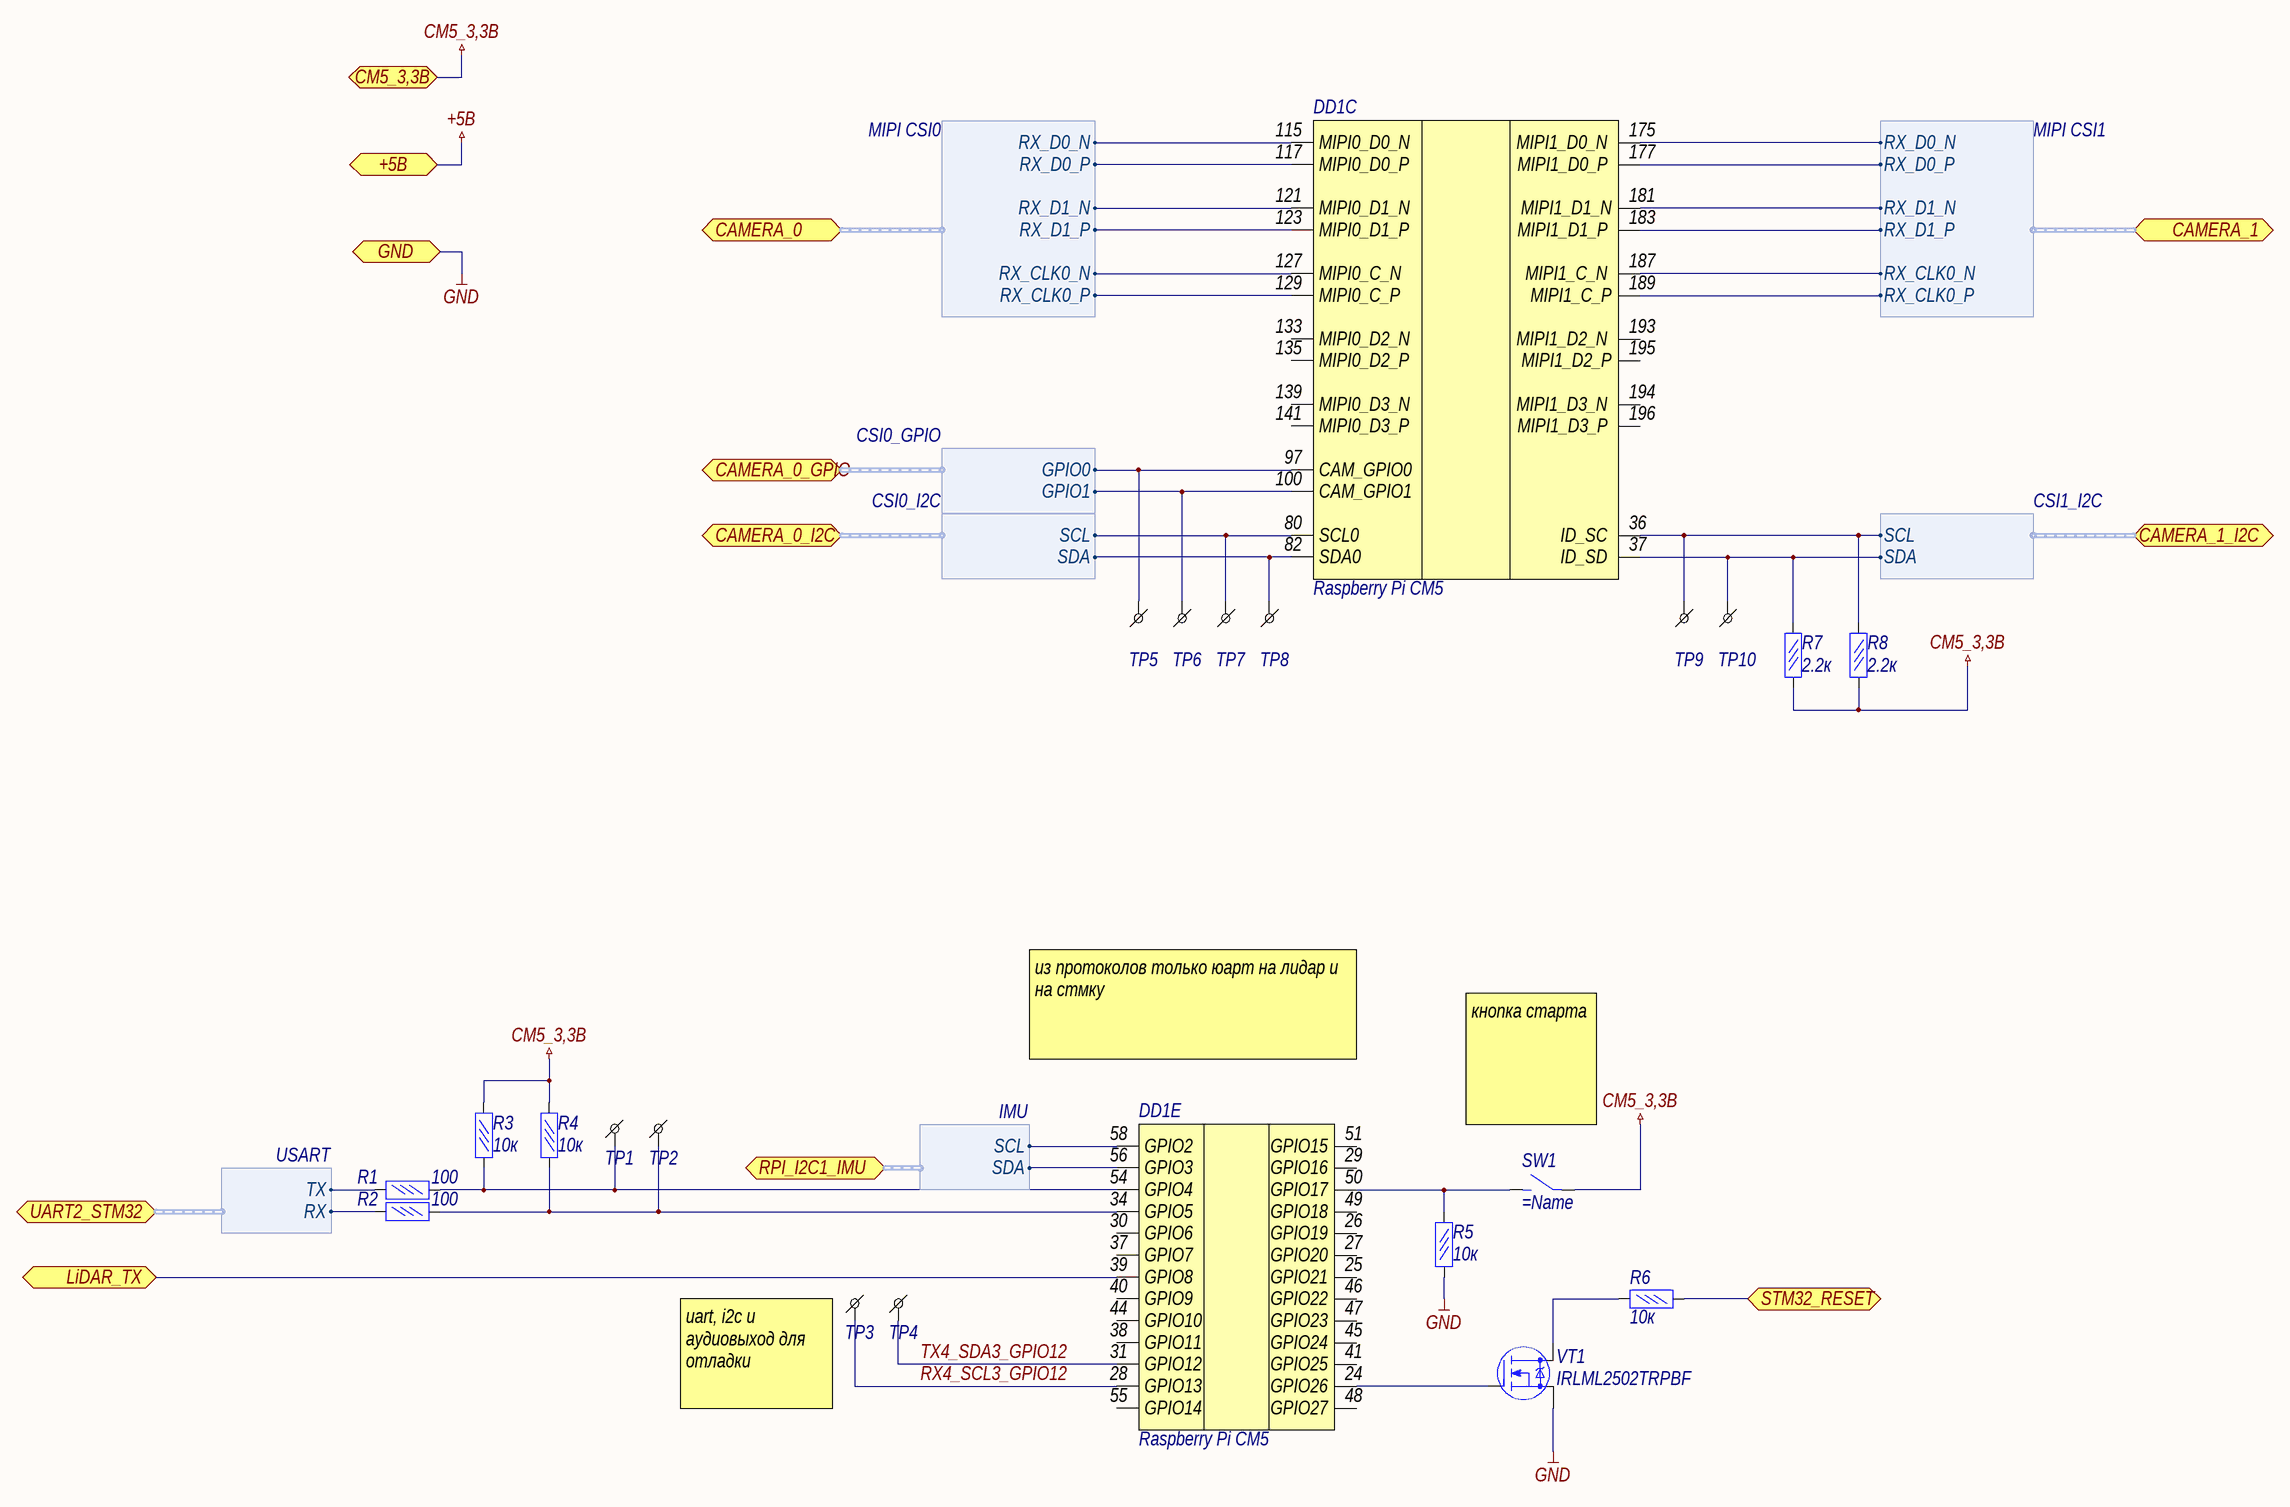
[diagram p4: MB_rpi_sys.SchDoc]

### Parts
DD1  Raspberry Pi CM5  [raspberry_pi_compute_module_4_header]  (parts C,E of 6)
R1  100  [R0402]
R2  100  [R0402]
R3  10к  [R0402]
R4  10к  [R0402]
R5  10к  [R0402]
R6  10к  [R0402]
R7  2.2к  [R0402]
R8  2.2к  [R0402]
SW1  (no value)  [KTD0621]
TP1  TestPoint  [0.5 x 0,9_round]  (value not drawn)
TP2  TestPoint  [0.5 x 0,9_round]  (value not drawn)
TP3  TestPoint  [0.5 x 0,9_round]  (value not drawn)
TP4  TestPoint  [0.5 x 0,9_round]  (value not drawn)
TP5  TestPoint  [0.5 x 0,9_round]  (value not drawn)
TP6  TestPoint  [0.5 x 0,9_round]  (value not drawn)
TP7  TestPoint  [0.5 x 0,9_round]  (value not drawn)
TP8  TestPoint  [0.5 x 0,9_round]  (value not drawn)
TP9  TestPoint  [0.5 x 0,9_round]  (value not drawn)
TP10  TestPoint  [0.5 x 0,9_round]  (value not drawn)
VT1  IRLML2502TRPBF  [SOT23]

### Ports
+5В (bidir), CAMERA_0 (bidir, harness MIPI CSI0), CAMERA_0_GPIO (bidir, harness CSI0_GPIO), CAMERA_0_I2C (bidir, harness CSI0_I2C), CAMERA_1 (bidir, harness MIPI CSI1), CAMERA_1_I2C (bidir, harness CSI1_I2C), CM5_3,3В (bidir), GND (bidir), LiDAR_TX (bidir), RPI_I2C1_IMU (bidir, harness IMU), STM32_RESET (bidir), UART2_STM32 (bidir, harness USART)

### Harnesses
MIPI CSI1: RX_D0_N, RX_D0_P, RX_D1_N, RX_D1_P, RX_CLK0_N, RX_CLK0_P
MIPI CSI0: RX_D0_N, RX_D0_P, RX_D1_N, RX_D1_P, RX_CLK0_N, RX_CLK0_P
CSI0_GPIO: GPIO0, GPIO1
CSI0_I2C: SCL, SDA
CSI1_I2C: SCL, SDA
USART: RX, TX
IMU: SDA, SCL

### Nets
CM5_3,3В: R3.2 R4.2 R7.1 R8.1 SW1.1 ; port CM5_3,3В
GND: R5.1 VT1.2(S) ; port GND
LiDAR_TX: DD1.39(GPIO8) ; port LiDAR_TX
RX4_SCL3_GPIO12: DD1.28(GPIO13) TP3.1  [project net RX4_SCL3_GPIO12_3]
STM32_RESET: R6.1 ; port STM32_RESET
TX4_SDA3_GPIO12: DD1.31(GPIO12) TP4.1  [project net TX4_SDA3_GPIO12_3]
NetDD1_24: DD1.24(GPIO26) VT1.1(G)
NetDD1_34: DD1.34(GPIO5) R2.2 R4.1 TP2.1
NetDD1_36: DD1.36(ID_SC) R8.2 TP9.1 ; port CAMERA_1_I2C.SCL
NetDD1_37: DD1.37(ID_SD) R7.2 TP10.1 ; port CAMERA_1_I2C.SDA
NetDD1_50: DD1.50(GPIO17) R5.2 SW1.2
NetDD1_54: DD1.54(GPIO4) R1.2 R3.1 TP1.1
NetDD1_56: DD1.56(GPIO3) ; port RPI_I2C1_IMU.SDA
NetDD1_58: DD1.58(GPIO2) ; port RPI_I2C1_IMU.SCL
NetDD1_80: DD1.80(SCL0) TP7.1 ; port CAMERA_0_I2C.SCL
NetDD1_82: DD1.82(SDA0) TP8.1 ; port CAMERA_0_I2C.SDA
NetDD1_97: DD1.97(CAM_GPIO0) TP5.1 ; port CAMERA_0_GPIO.GPIO0
NetDD1_100: DD1.100(CAM_GPIO1) TP6.1 ; port CAMERA_0_GPIO.GPIO1
NetDD1_115: DD1.115(MIPI0_D0_N) ; port CAMERA_0.RX_D0_N
NetDD1_117: DD1.117(MIPI0_D0_P) ; port CAMERA_0.RX_D0_P
NetDD1_121: DD1.121(MIPI0_D1_N) ; port CAMERA_0.RX_D1_N
NetDD1_123: DD1.123(MIPI0_D1_P) ; port CAMERA_0.RX_D1_P
NetDD1_127: DD1.127(MIPI0_C_N) ; port CAMERA_0.RX_CLK0_N
NetDD1_129: DD1.129(MIPI0_C_P) ; port CAMERA_0.RX_CLK0_P
NetDD1_175: DD1.175(MIPI1_D0_N) ; port CAMERA_1.RX_D0_N
NetDD1_177: DD1.177(MIPI1_D0_P) ; port CAMERA_1.RX_D0_P
NetDD1_181: DD1.181(MIPI1_D1_N) ; port CAMERA_1.RX_D1_N
NetDD1_183: DD1.183(MIPI1_D1_P) ; port CAMERA_1.RX_D1_P
NetDD1_187: DD1.187(MIPI1_C_N) ; port CAMERA_1.RX_CLK0_N
NetDD1_189: DD1.189(MIPI1_C_P) ; port CAMERA_1.RX_CLK0_P
NetR1_1: R1.1 ; port UART2_STM32.TX
NetR2_1: R2.1 ; port UART2_STM32.RX
NetR6_2: R6.2 VT1.3(D)

Not connected (* = marked no-connect by the designer): DD1 25(GPIO21) 26(GPIO19) 27(GPIO20) 29(GPIO16) 30(GPIO6) 38(GPIO11) 40(GPIO9) 41(GPIO25) 44(GPIO10_) 45(GPIO24) 46(GPIO22) 47(GPIO23) 48(GPIO27) 49(GPIO18) 51(GPIO15) 55(GPIO14) 133(MIPI0_D2_N_) 135(MIPI0_D2_P_) 139(MIPI0_D3_N_) 141(MIPI0_D3_P_) 193(MIPI1_D2_N_) 194(MIPI1_D3_N_) 195(MIPI1_D2_P) 196(MIPI1_D3_P_)

### Notes on the sheet
- из протоколов только юарт на лидар и на стмку
- кнопка старта
- (near TP3) uart, i2c и аудиовыход для отладки
- Подп. и дата
- Инв. № дубл.
- Взам. инв. №
- Инв. № подл.
- Лист
- Изм.
- № докум.
- Подп.
- Дата
- Копировал
- Формат
- А1

### Library data of the parts
DD1 = Raspberry Pi CM5: Raspberry Pi Compute Module 5; Name: Raspberry Pi CM5
R1-R8 = Резистор 0.05Вт: Резистор 0,05Вт
  R1 R2: Value: 100
  R3-R6: Value: 10к
  R7 R8: Value: 2.2к
SW1 = button
VT1 = IRLML2502TRPBF: мосфет n-канал IRLML2502TRPBF; Name: IRLML2502TRPBF

## Sheet MB_peripherial.SchDoc
size 840 x 594 mm; SheetNumber: 8; SheetTotal: 8
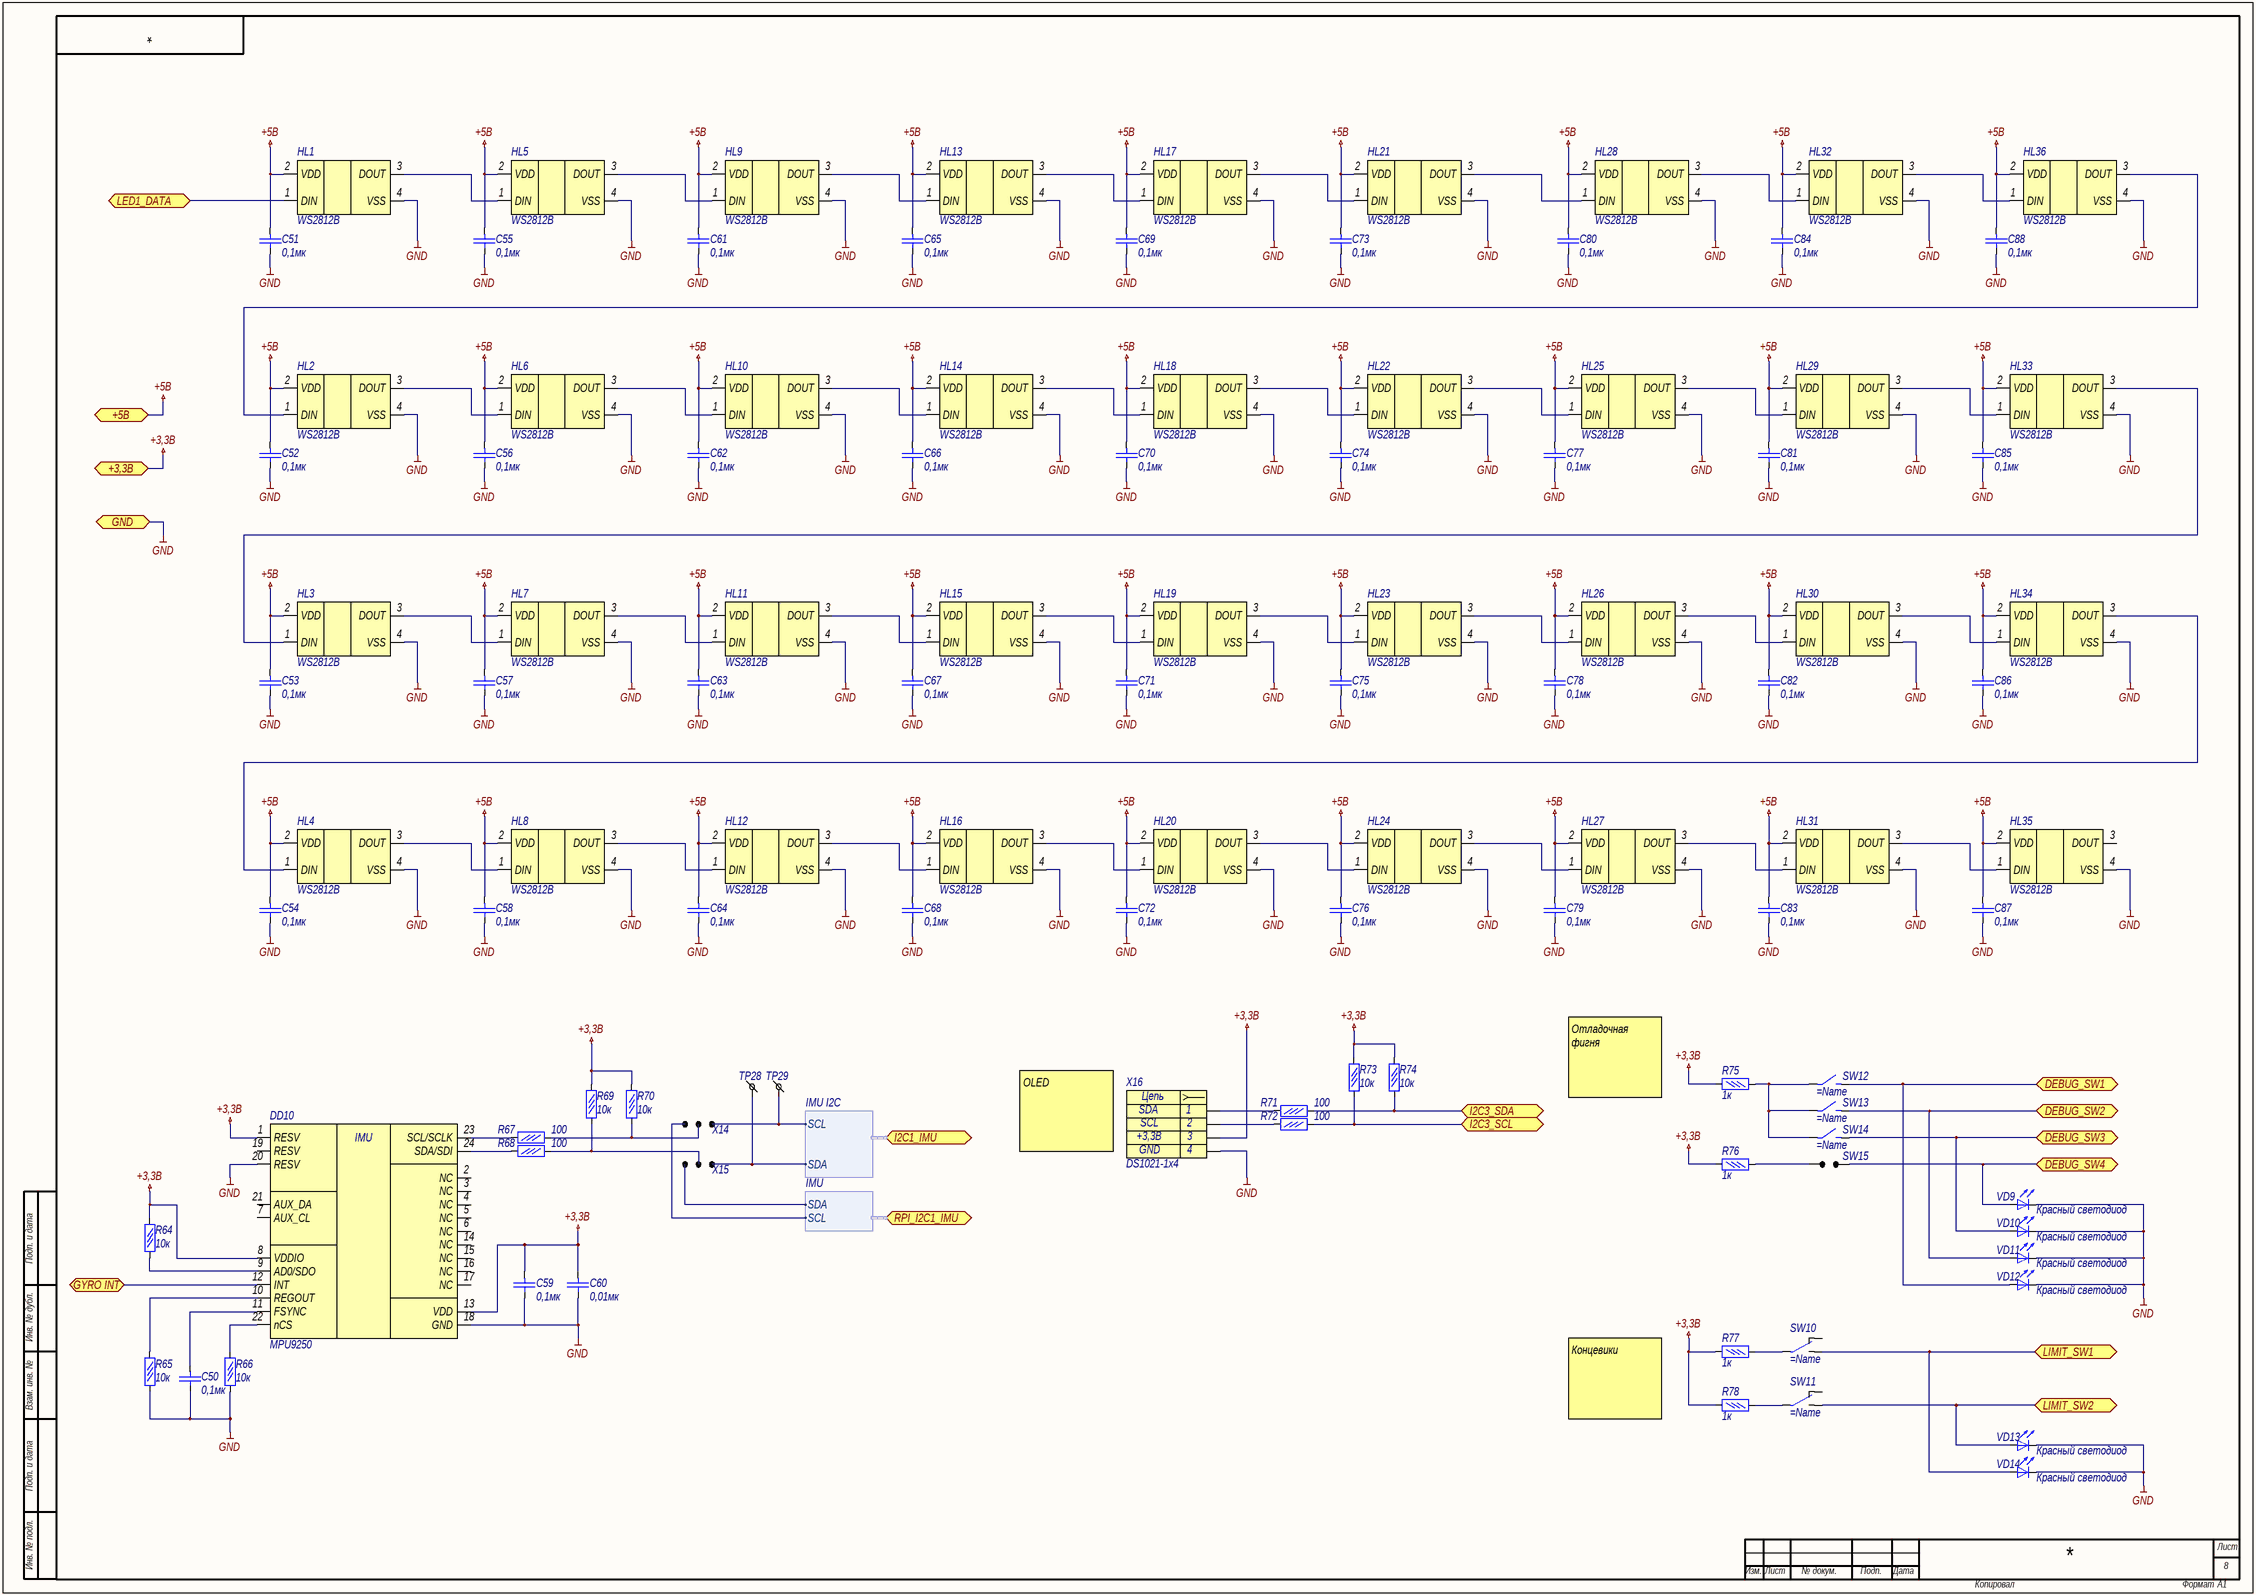
[diagram p5: MB_peripherial.SchDoc]

### Parts
DD10  MPU9250  [QFN24-PAD]
HL1  WS2812B  [ws2812b 4020]
HL2  WS2812B  [ws2812b 4020]
HL3  WS2812B  [ws2812b 4020]
HL4  WS2812B  [ws2812b 4020]
HL5  WS2812B  [ws2812b 4020]
HL6  WS2812B  [ws2812b 4020]
HL7  WS2812B  [ws2812b 4020]
HL8  WS2812B  [ws2812b 4020]
HL9  WS2812B  [ws2812b 4020]
HL10  WS2812B  [ws2812b 4020]
HL11  WS2812B  [ws2812b 4020]
HL12  WS2812B  [ws2812b 4020]
HL13  WS2812B  [ws2812b 4020]
HL14  WS2812B  [ws2812b 4020]
HL15  WS2812B  [ws2812b 4020]
HL16  WS2812B  [ws2812b 4020]
HL17  WS2812B  [ws2812b 4020]
HL18  WS2812B  [ws2812b 4020]
HL19  WS2812B  [ws2812b 4020]
HL20  WS2812B  [ws2812b 4020]
HL21  WS2812B  [ws2812b 4020]
HL22  WS2812B  [ws2812b 4020]
HL23  WS2812B  [ws2812b 4020]
HL24  WS2812B  [ws2812b 4020]
HL25  WS2812B  [ws2812b 4020]
HL26  WS2812B  [ws2812b 4020]
HL27  WS2812B  [ws2812b 4020]
HL28  WS2812B  [ws2812b 4020]
HL29  WS2812B  [ws2812b 4020]
HL30  WS2812B  [ws2812b 4020]
HL31  WS2812B  [ws2812b 4020]
HL32  WS2812B  [ws2812b 4020]
HL33  WS2812B  [ws2812b 4020]
HL34  WS2812B  [ws2812b 4020]
HL35  WS2812B  [ws2812b 4020]
HL36  WS2812B  [ws2812b 4020]
R64  10к  [R0402]
R65  10к  [R0402]
R66  10к  [R0402]
R67  100  [R0402]
R68  100  [R0402]
R69  10к  [R0402]
R70  10к  [R0402]
R71  100  [R0402]
R72  100  [R0402]
R73  10к  [R0402]
R74  10к  [R0402]
R75  1к  [R0402]
R76  1к  [R0402]
R77  1к  [R0402]
R78  1к  [R0402]
SW10  (no value)  [limit switch]
SW11  (no value)  [limit switch]
SW12  (no value)  [it-1187]
SW13  (no value)  [it-1187]
SW14  (no value)  [OMRON_B3U-1000P]
SW15  (no value)  [PLD 1.27X2]
TP28  TestPoint  [0.5 x 0,9_round]  (value not drawn)
TP29  TestPoint  [0.5 x 0,9_round]  (value not drawn)
VD9  Красный светодиод  [0603 - led]
VD10  Красный светодиод  [0603 - led]
VD11  Красный светодиод  [0603 - led]
VD12  Красный светодиод  [0603 - led]
VD13  Красный светодиод  [0603 - led]
VD14  Красный светодиод  [0603 - led - no point]
X14  Jumper_3  [solid_jumper_3]  (value not drawn)  (no BOM)
X15  Jumper_3  [solid_jumper_3]  (value not drawn)  (no BOM)
X16  DS1021-1x4  [PLS_1x4 - emty]
С50  0,1мк  [C0402]
С51  0,1мк  [C0402]
С52  0,1мк  [C0402]
С53  0,1мк  [C0402]
С54  0,1мк  [C0402]
С55  0,1мк  [C0402]
С56  0,1мк  [C0402]
С57  0,1мк  [C0402]
С58  0,1мк  [C0402]
С59  0,1мк  [C0402]
С60  0,01мк  [C0402]
С61  0,1мк  [C0402]
С62  0,1мк  [C0402]
С63  0,1мк  [C0402]
С64  0,1мк  [C0402]
С65  0,1мк  [C0402]
С66  0,1мк  [C0402]
С67  0,1мк  [C0402]
С68  0,1мк  [C0402]
С69  0,1мк  [C0402]
С70  0,1мк  [C0402]
С71  0,1мк  [C0402]
С72  0,1мк  [C0402]
С73  0,1мк  [C0402]
С74  0,1мк  [C0402]
С75  0,1мк  [C0402]
С76  0,1мк  [C0402]
С77  0,1мк  [C0402]
С78  0,1мк  [C0402]
С79  0,1мк  [C0402]
С80  0,1мк  [C0402]
С81  0,1мк  [C0402]
С82  0,1мк  [C0402]
С83  0,1мк  [C0402]
С84  0,1мк  [C0402]
С85  0,1мк  [C0402]
С86  0,1мк  [C0402]
С87  0,1мк  [C0402]
С88  0,1мк  [C0402]

### Ports
+3,3В (bidir), +5В (bidir), DEBUG_SW1 (bidir), DEBUG_SW2 (bidir), DEBUG_SW3 (bidir), DEBUG_SW4 (bidir), GND (bidir), GYRO INT (bidir), I2C1_IMU (bidir, harness IMU I2C), I2C3_SCL (bidir), I2C3_SDA (bidir), LED1_DATA (bidir), LIMIT_SW1 (bidir), LIMIT_SW2 (bidir), RPI_I2C1_IMU (bidir, harness IMU)

### Harnesses
IMU I2C: SDA, SCL
IMU: SDA, SCL

### Nets
+3,3В: DD10.1(RESV) DD10.8(VDDIO) DD10.13(VDD) R64.2 R69.2 R70.2 R73.2 R74.2 R75.2 R76.2 R77.2 R78.2 X16.3 С59.2 С60.2 ; port +3,3В
+5В: HL1.2(VDD) HL2.2(VDD) HL3.2(VDD) HL4.2(VDD) HL5.2(VDD) HL6.2(VDD) HL7.2(VDD) HL8.2(VDD) HL9.2(VDD) HL10.2(VDD) HL11.2(VDD) HL12.2(VDD) HL13.2(VDD) HL14.2(VDD) HL15.2(VDD) HL16.2(VDD) HL17.2(VDD) HL18.2(VDD) HL19.2(VDD) HL20.2(VDD) HL21.2(VDD) HL22.2(VDD) HL23.2(VDD) HL24.2(VDD) HL25.2(VDD) HL26.2(VDD) HL27.2(VDD) HL28.2(VDD) HL29.2(VDD) HL30.2(VDD) HL31.2(VDD) HL32.2(VDD) HL33.2(VDD) HL34.2(VDD) HL35.2(VDD) HL36.2(VDD) С51.2 С52.2 С53.2 С54.2 С55.2 С56.2 С57.2 С58.2 С61.2 С62.2 С63.2 С64.2 С65.2 С66.2 С67.2 С68.2 С69.2 С70.2 С71.2 С72.2 С73.2 С74.2 С75.2 С76.2 С77.2 С78.2 С79.2 С80.2 С81.2 С82.2 С83.2 С84.2 С85.2 С86.2 С87.2 С88.2 ; port +5В
GND: DD10.18(GND) DD10.20(RESV) HL1.4(VSS) HL2.4(VSS) HL3.4(VSS) HL4.4(VSS) HL5.4(VSS) HL6.4(VSS) HL7.4(VSS) HL8.4(VSS) HL9.4(VSS) HL10.4(VSS) HL11.4(VSS) HL12.4(VSS) HL13.4(VSS) HL14.4(VSS) HL15.4(VSS) HL16.4(VSS) HL17.4(VSS) HL18.4(VSS) HL19.4(VSS) HL20.4(VSS) HL21.4(VSS) HL22.4(VSS) HL23.4(VSS) HL24.4(VSS) HL25.4(VSS) HL26.4(VSS) HL27.4(VSS) HL28.4(VSS) HL29.4(VSS) HL30.4(VSS) HL31.4(VSS) HL32.4(VSS) HL33.4(VSS) HL34.4(VSS) HL35.4(VSS) HL36.4(VSS) R65.1 R66.1 VD9.2(K) VD10.2(K) VD11.2(K) VD12.2(K) VD13.2(K) VD14.2(K) X16.4 С50.1 С51.1 С52.1 С53.1 С54.1 С55.1 С56.1 С57.1 С58.1 С59.1 С60.1 С61.1 С62.1 С63.1 С64.1 С65.1 С66.1 С67.1 С68.1 С69.1 С70.1 С71.1 С72.1 С73.1 С74.1 С75.1 С76.1 С77.1 С78.1 С79.1 С80.1 С81.1 С82.1 С83.1 С84.1 С85.1 С86.1 С87.1 С88.1 ; port GND
DEBUG_SW1: SW12.2 VD12.1(A) ; port DEBUG_SW1
DEBUG_SW2: SW13.2 VD11.1(A) ; port DEBUG_SW2
DEBUG_SW3: SW14.2 VD10.1(A) ; port DEBUG_SW3
DEBUG_SW4: SW15.2 VD9.1(A) ; port DEBUG_SW4
GYRO INT: DD10.12(INT) ; port GYRO INT
I2C1_SCL: TP29.1 X14.1 ; port I2C1_IMU.SCL
I2C1_SDA: TP28.1 X15.1 ; port I2C1_IMU.SDA
I2C3_SCL: R72.1 R73.1 ; port I2C3_SCL
I2C3_SDA: R71.1 R74.1 ; port I2C3_SDA
LED1_DATA: HL1.1(DIN) ; port LED1_DATA
LIMIT_SW1: SW10.1 VD14.1(A) ; port LIMIT_SW1
LIMIT_SW2: SW11.1 VD13.1(A) ; port LIMIT_SW2
NetDD1_56: X15.3 ; port RPI_I2C1_IMU.SDA
NetDD1_58: X14.3 ; port RPI_I2C1_IMU.SCL
NetDD10_9: DD10.9(AD0/SDO) R64.1
NetDD10_10: DD10.10(REGOUT) R65.2
NetDD10_11: DD10.11(FSYNC) С50.2
NetDD10_22: DD10.22(nCS) R66.2
NetDD10_23: DD10.23(SCL/SCLK) R67.2
NetDD10_24: DD10.24(SDA/SDI) R68.2
NetHL1_3: HL1.3(DOUT) HL5.1(DIN)
NetHL2_1: HL2.1(DIN) HL36.3(DOUT)
NetHL2_3: HL2.3(DOUT) HL6.1(DIN)
NetHL3_1: HL3.1(DIN) HL33.3(DOUT)
NetHL3_3: HL3.3(DOUT) HL7.1(DIN)
NetHL4_1: HL4.1(DIN) HL34.3(DOUT)
NetHL4_3: HL4.3(DOUT) HL8.1(DIN)
NetHL5_3: HL5.3(DOUT) HL9.1(DIN)
NetHL6_3: HL6.3(DOUT) HL10.1(DIN)
NetHL7_3: HL7.3(DOUT) HL11.1(DIN)
NetHL8_3: HL8.3(DOUT) HL12.1(DIN)
NetHL9_3: HL9.3(DOUT) HL13.1(DIN)
NetHL10_3: HL10.3(DOUT) HL14.1(DIN)
NetHL11_3: HL11.3(DOUT) HL15.1(DIN)
NetHL12_3: HL12.3(DOUT) HL16.1(DIN)
NetHL13_3: HL13.3(DOUT) HL17.1(DIN)
NetHL14_3: HL14.3(DOUT) HL18.1(DIN)
NetHL15_3: HL15.3(DOUT) HL19.1(DIN)
NetHL16_3: HL16.3(DOUT) HL20.1(DIN)
NetHL17_3: HL17.3(DOUT) HL21.1(DIN)
NetHL18_3: HL18.3(DOUT) HL22.1(DIN)
NetHL19_3: HL19.3(DOUT) HL23.1(DIN)
NetHL20_3: HL20.3(DOUT) HL24.1(DIN)
NetHL21_3: HL21.3(DOUT) HL28.1(DIN)
NetHL22_3: HL22.3(DOUT) HL25.1(DIN)
NetHL23_3: HL23.3(DOUT) HL26.1(DIN)
NetHL24_3: HL24.3(DOUT) HL27.1(DIN)
NetHL25_3: HL25.3(DOUT) HL29.1(DIN)
NetHL26_3: HL26.3(DOUT) HL30.1(DIN)
NetHL27_3: HL27.3(DOUT) HL31.1(DIN)
NetHL28_3: HL28.3(DOUT) HL32.1(DIN)
NetHL29_3: HL29.3(DOUT) HL33.1(DIN)
NetHL30_3: HL30.3(DOUT) HL34.1(DIN)
NetHL31_3: HL31.3(DOUT) HL35.1(DIN)
NetHL32_3: HL32.3(DOUT) HL36.1(DIN)
NetR67_1: R67.1 R70.1 X14.2
NetR68_1: R68.1 R69.1 X15.2
NetR71_2: R71.2 X16.1
NetR72_2: R72.2 X16.2
NetR75_1: R75.1 SW12.1 SW13.1 SW14.1
NetR76_1: R76.1 SW15.1
NetR77_1: R77.1 SW10.3
NetR78_1: R78.1 SW11.3

Not connected (* = marked no-connect by the designer): DD10 2(NC) 3(NC) 4(NC) 5(NC) 6(NC) 7(AUX_CL) 14(NC) 15(NC) 16(NC) 17(NC) 19(RESV) 21(AUX_DA); HL35 3(DOUT); SW10 2; SW11 2

### Notes on the sheet
- Отладочная фигня
- OLED
- Концевики
- Подп. и дата
- Инв. № дубл.
- Взам. инв. №
- Инв. № подл.
- Лист
- Изм.
- № докум.
- Подп.
- Дата
- Копировал
- Формат
- А1
- (in symbol MPU9250) IMU
- (in symbol PLS 1 x 4) Цепь

### Library data of the parts
HL1-HL36 = WS2812B: адресный светодиод на микросхеме WS2812b; Name: WS2812B
R64-R78 = Резистор 0.05Вт: Резистор 0,05Вт
  R64-R66 R69 R70 R73 R74: Value: 10к
  R67 R68 R71 R72: Value: 100
  R75-R78: Value: 1к
SW10 SW11 = Концевой выключатель
SW12-SW14 = button
SW15 = Jumper: Перемычка
VD9-VD14 = SMD светодиод: Светодтод SMD; Name: Красный светодиод
X14 X15 = Jumper x3: as X2 on sheet MB_USB; Value: Jumper_3
X16 = PLS 1 x 4: Contact_1: SDA; Contact_2: SCL; Contact_3: +3,3В; Contact_4: GND; Name: DS1021-1x4
С50-С88 = Кер. конденсатор
  С50-С59 С61-С88: Value: 0,1мк
  С60: Value: 0,01мк
DD10 = MPU9250: Name: MPU9250

## Sheet MB_drivers.SchDoc
size 594 x 420 mm; SheetNumber: 7; SheetTotal: 8
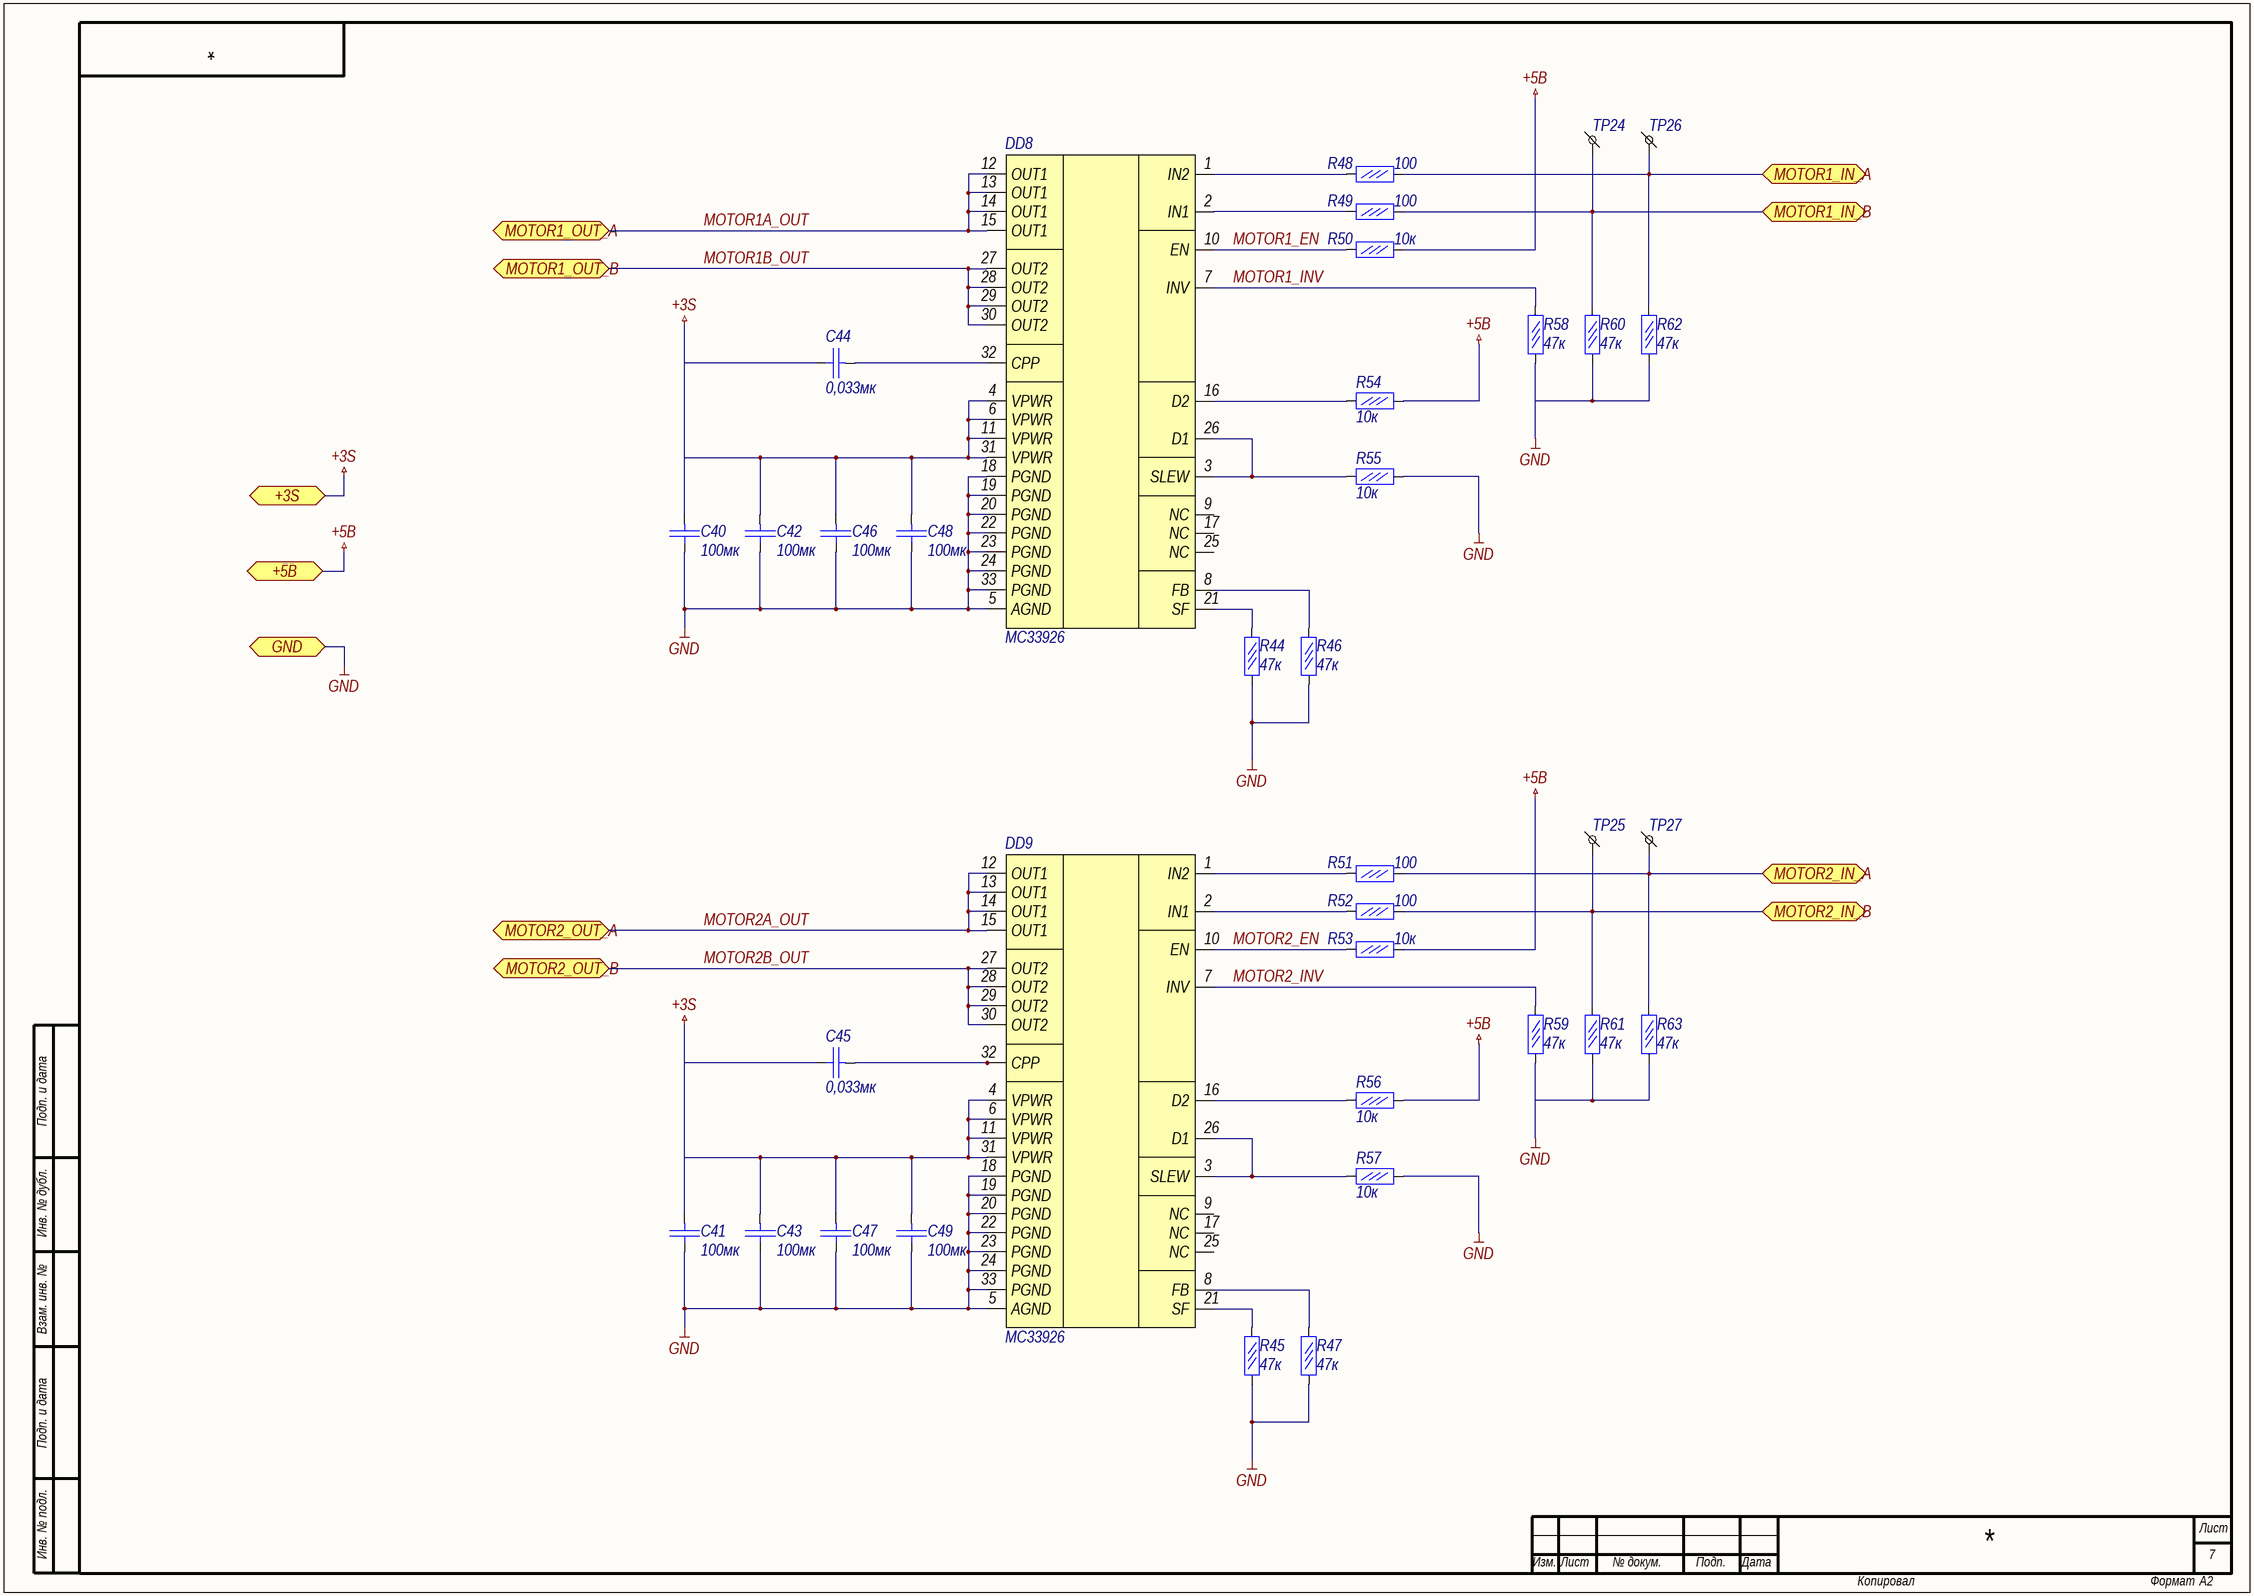
[diagram p6: MB_drivers.SchDoc]

### Parts
DD8  MС33926  [PQFN32]
DD9  MС33926  [PQFN32]
R44  47к  [R0402]
R45  47к  [R0402]
R46  47к  [R0402]
R47  47к  [R0402]
R48  100  [R0402]
R49  100  [R0402]
R50  10к  [R0402]
R51  100  [R0402]
R52  100  [R0402]
R53  10к  [R0402]
R54  10к  [R0402]
R55  10к  [R0402]
R56  10к  [R0402]
R57  10к  [R0402]
R58  47к  [R0402]
R59  47к  [R0402]
R60  47к  [R0402]
R61  47к  [R0402]
R62  47к  [R0402]
R63  47к  [R0402]
TP24  TestPoint  [0.5 x 0,9_round]  (value not drawn)
TP25  TestPoint  [0.5 x 0,9_round]  (value not drawn)
TP26  TestPoint  [0.5 x 0,9_round]  (value not drawn)
TP27  TestPoint  [0.5 x 0,9_round]  (value not drawn)
С40  100мк  [C1210_AA - 2.5]
С41  100мк  [C1210_AA - 2.5]
С42  100мк  [C1210_AA - 2.5]
С43  100мк  [C1210_AA - 2.5]
С44  0,033мк  [C0402]
С45  0,033мк  [C0402]
С46  100мк  [C1210_AA - 2.5]
С47  100мк  [C1210_AA - 2.5]
С48  100мк  [C1210_AA - 2.5]
С49  100мк  [C1210_AA - 2.5]

### Ports
+3S (bidir), +5В (bidir), GND (bidir), MOTOR1_IN_A (bidir), MOTOR1_IN_B (bidir), MOTOR1_OUT_A (bidir), MOTOR1_OUT_B (bidir), MOTOR2_IN_A (bidir), MOTOR2_IN_B (bidir), MOTOR2_OUT_A (bidir), MOTOR2_OUT_B (bidir)

### Nets
+3S: DD8.4(VPWR) DD8.6(VPWR) DD8.11(VPWR) DD8.31(VPWR) DD9.4(VPWR) DD9.6(VPWR) DD9.11(VPWR) DD9.31(VPWR) С40.2 С41.2 С42.2 С43.2 С44.1 С45.1 С46.2 С47.2 С48.2 С49.2 ; port +3S
+5В: R50.1 R53.1 R54.1 R56.1 ; port +5В
GND: DD8.5(AGND) DD8.18(PGND) DD8.19(PGND) DD8.20(PGND) DD8.22(PGND) DD8.23(PGND) DD8.24(PGND) DD8.33(PGND) DD9.5(AGND) DD9.18(PGND) DD9.19(PGND) DD9.20(PGND) DD9.22(PGND) DD9.23(PGND) DD9.24(PGND) DD9.33(PGND) R44.1 R45.1 R46.1 R47.1 R55.1 R57.1 R58.1 R59.1 R60.1 R61.1 R62.1 R63.1 С40.1 С41.1 С42.1 С43.1 С46.1 С47.1 С48.1 С49.1 ; port GND
MOTOR1_EN: DD8.10(EN) R50.2  [project net MOTOR1_EN_7]
MOTOR1_IN_A: R48.1 R62.2 TP26.1 ; port MOTOR1_IN_A
MOTOR1_IN_B: R49.1 R60.2 TP24.1 ; port MOTOR1_IN_B
MOTOR1_INV: DD8.7(INV) R58.2  [project net MOTOR1_INV_7]
MOTOR1A_OUT: DD8.12(OUT1) DD8.13(OUT1) DD8.14(OUT1) DD8.15(OUT1) ; port MOTOR1_OUT_A
MOTOR1B_OUT: DD8.27(OUT2) DD8.28(OUT2) DD8.29(OUT2) DD8.30(OUT2) ; port MOTOR1_OUT_B
MOTOR2_EN: DD9.10(EN) R53.2  [project net MOTOR2_EN_7]
MOTOR2_IN_A: R51.1 R63.2 TP27.1 ; port MOTOR2_IN_A
MOTOR2_IN_B: R52.1 R61.2 TP25.1 ; port MOTOR2_IN_B
MOTOR2_INV: DD9.7(INV) R59.2  [project net MOTOR2_INV_7]
MOTOR2A_OUT: DD9.12(OUT1) DD9.13(OUT1) DD9.14(OUT1) DD9.15(OUT1) ; port MOTOR2_OUT_A
MOTOR2B_OUT: DD9.27(OUT2) DD9.28(OUT2) DD9.29(OUT2) DD9.30(OUT2) ; port MOTOR2_OUT_B
NetDD8_1: DD8.1(IN2) R48.2
NetDD8_2: DD8.2(IN1) R49.2
NetDD8_3: DD8.3(SLEW) DD8.26(D1) R55.2
NetDD8_8: DD8.8(FB) R46.2
NetDD8_16: DD8.16(D2) R54.2
NetDD8_21: DD8.21(SF) R44.2
NetDD8_32: DD8.32(CPP) С44.2
NetDD9_1: DD9.1(IN2) R51.2
NetDD9_2: DD9.2(IN1) R52.2
NetDD9_3: DD9.3(SLEW) DD9.26(D1) R57.2
NetDD9_8: DD9.8(FB) R47.2
NetDD9_16: DD9.16(D2) R56.2
NetDD9_21: DD9.21(SF) R45.2
NetDD9_32: DD9.32(CPP) С45.2

Not connected (* = marked no-connect by the designer): DD8 9(NC) 17(NC) 25(NC); DD9 9(NC) 17(NC) 25(NC)

### Notes on the sheet
- Подп. и дата
- Инв. № дубл.
- Взам. инв. №
- Инв. № подл.
- Лист
- Изм.
- № докум.
- Подп.
- Дата
- Копировал
- Формат
- А2

### Library data of the parts
DD8 DD9 = MС33926: Драйвер мотора; Name: MС33926
R44-R63 = Резистор 0.05Вт: Резистор 0,05Вт
  R44-R47 R58-R63: Value: 47к
  R48 R49 R51 R52: Value: 100
  R50 R53-R57: Value: 10к
С40-С49 = Кер. конденсатор
  С40-С43 С46-С49: Value: 100мк
  С44 С45: Value: 0,033мк

## Sheet MB_commutation.SchDoc
size 594 x 420 mm; SheetNumber: 6; SheetTotal: 8
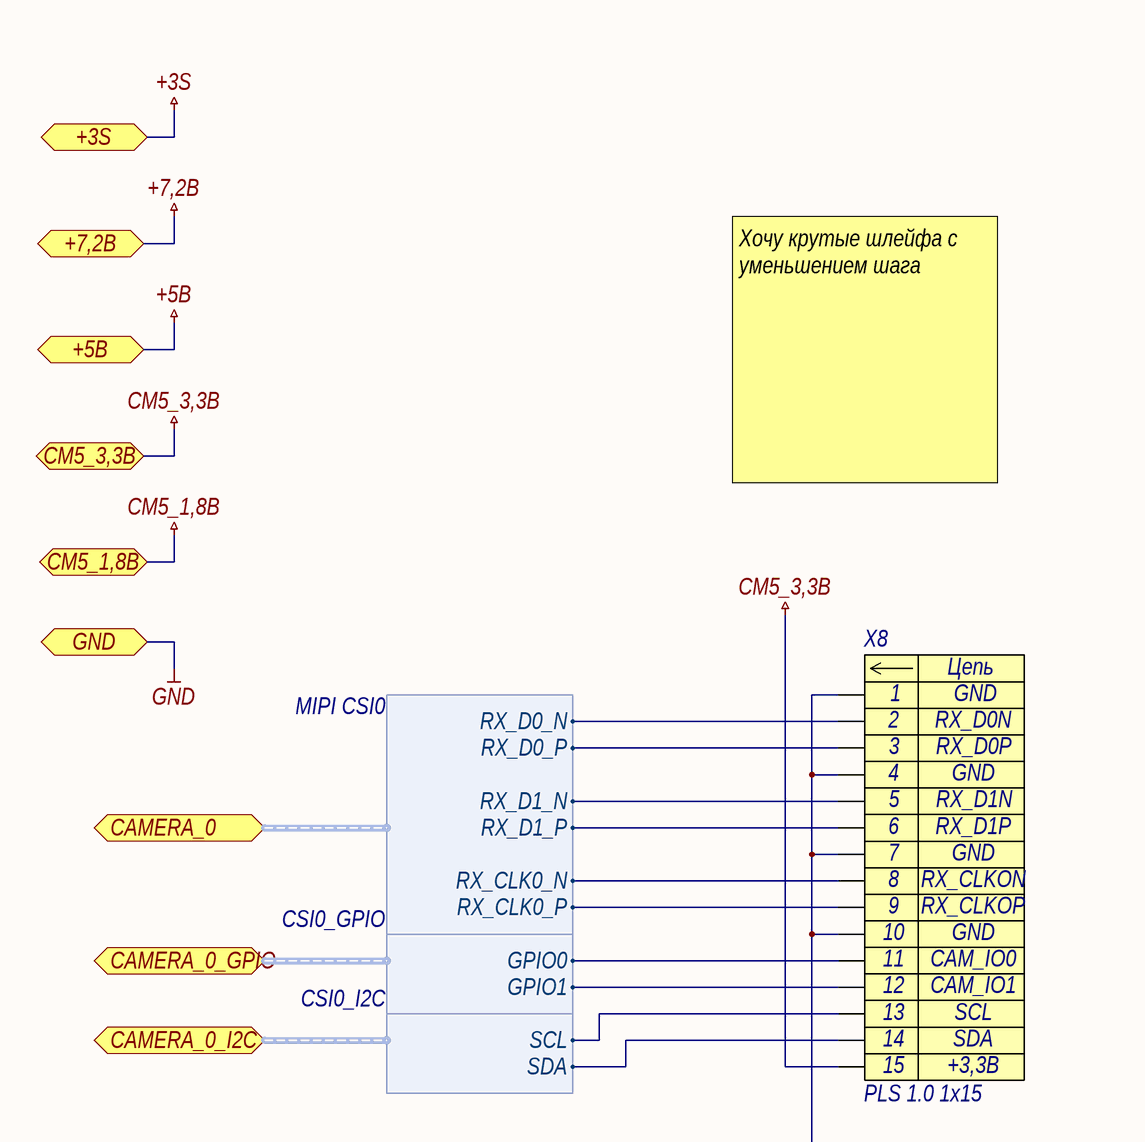
[diagram p7: MB_commutation.SchDoc, top left]
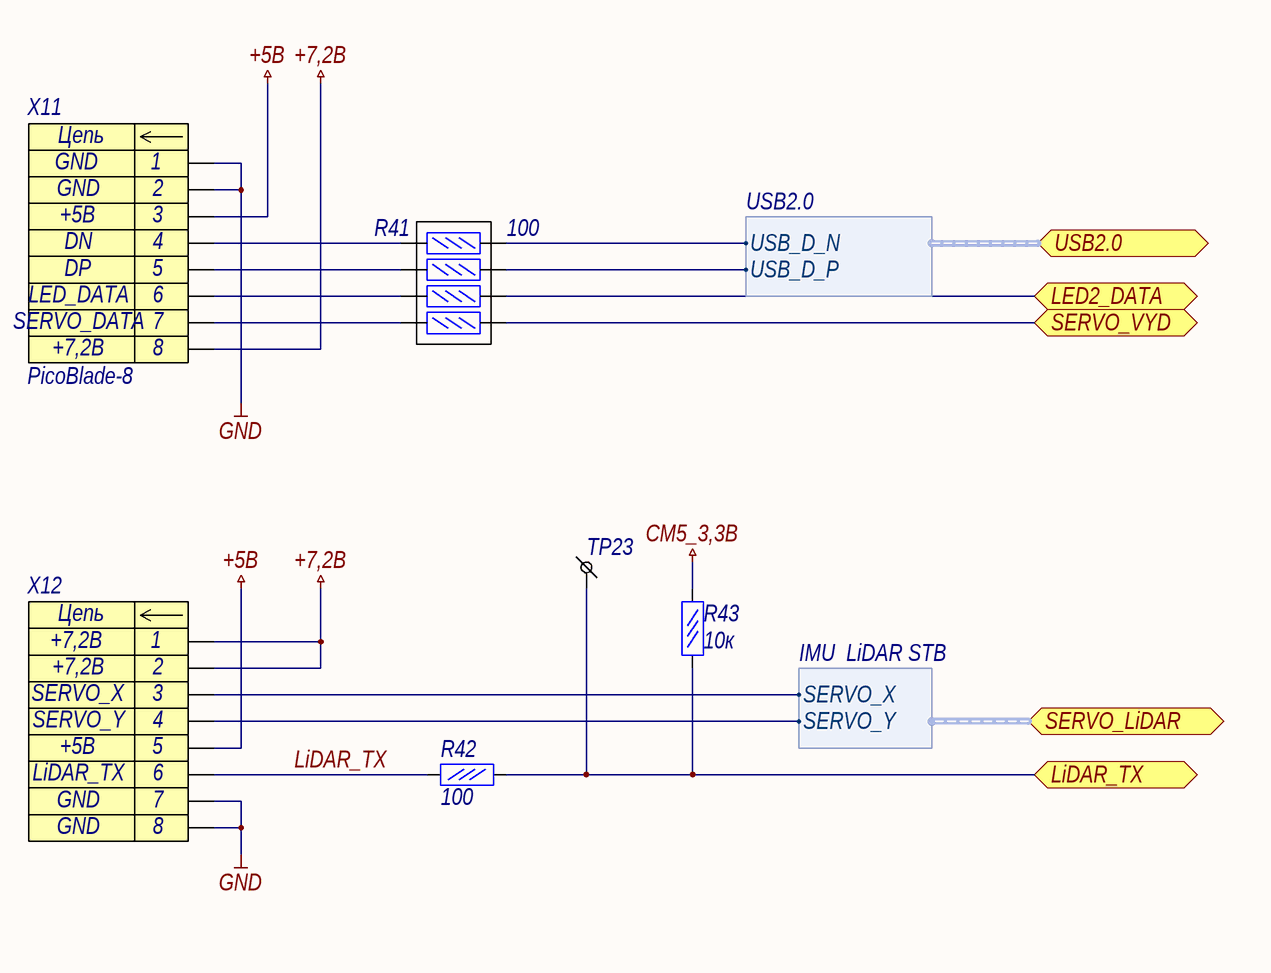
[diagram p8: MB_commutation.SchDoc, top right]
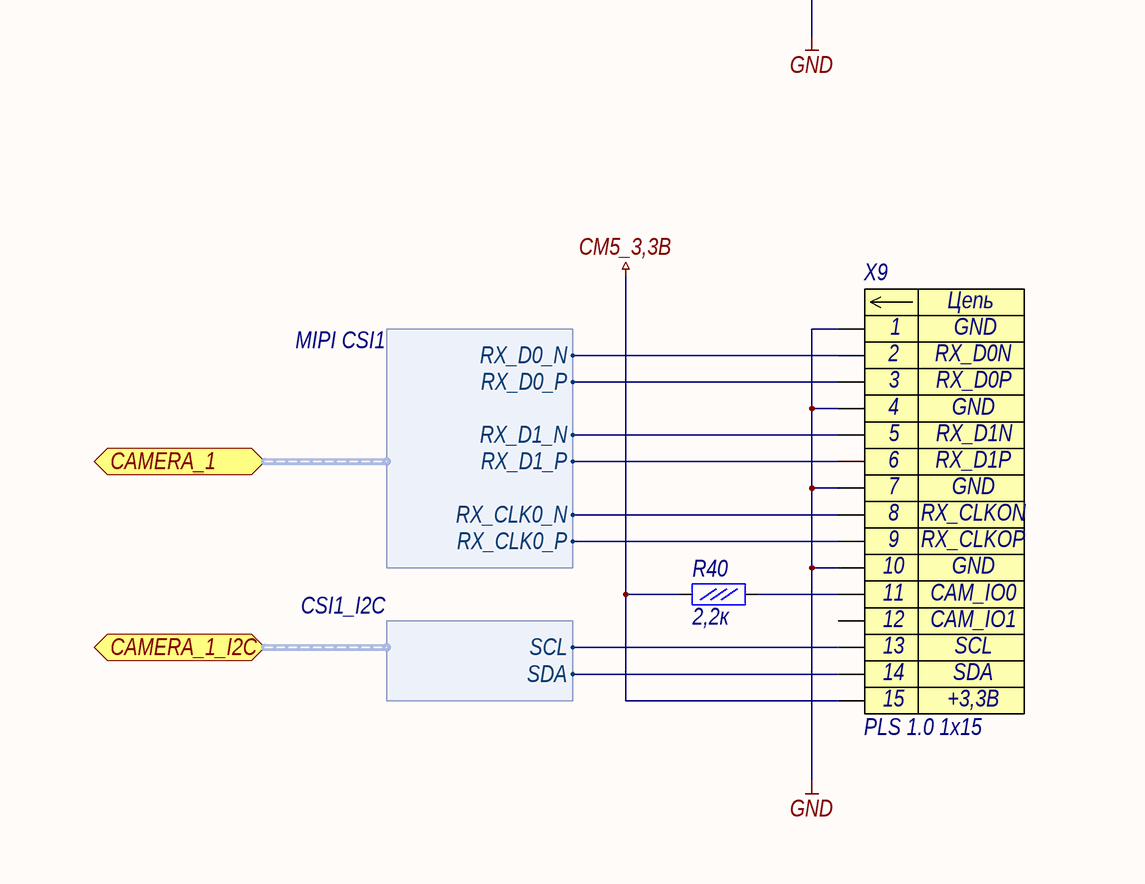
[diagram p9: MB_commutation.SchDoc, bottom left]
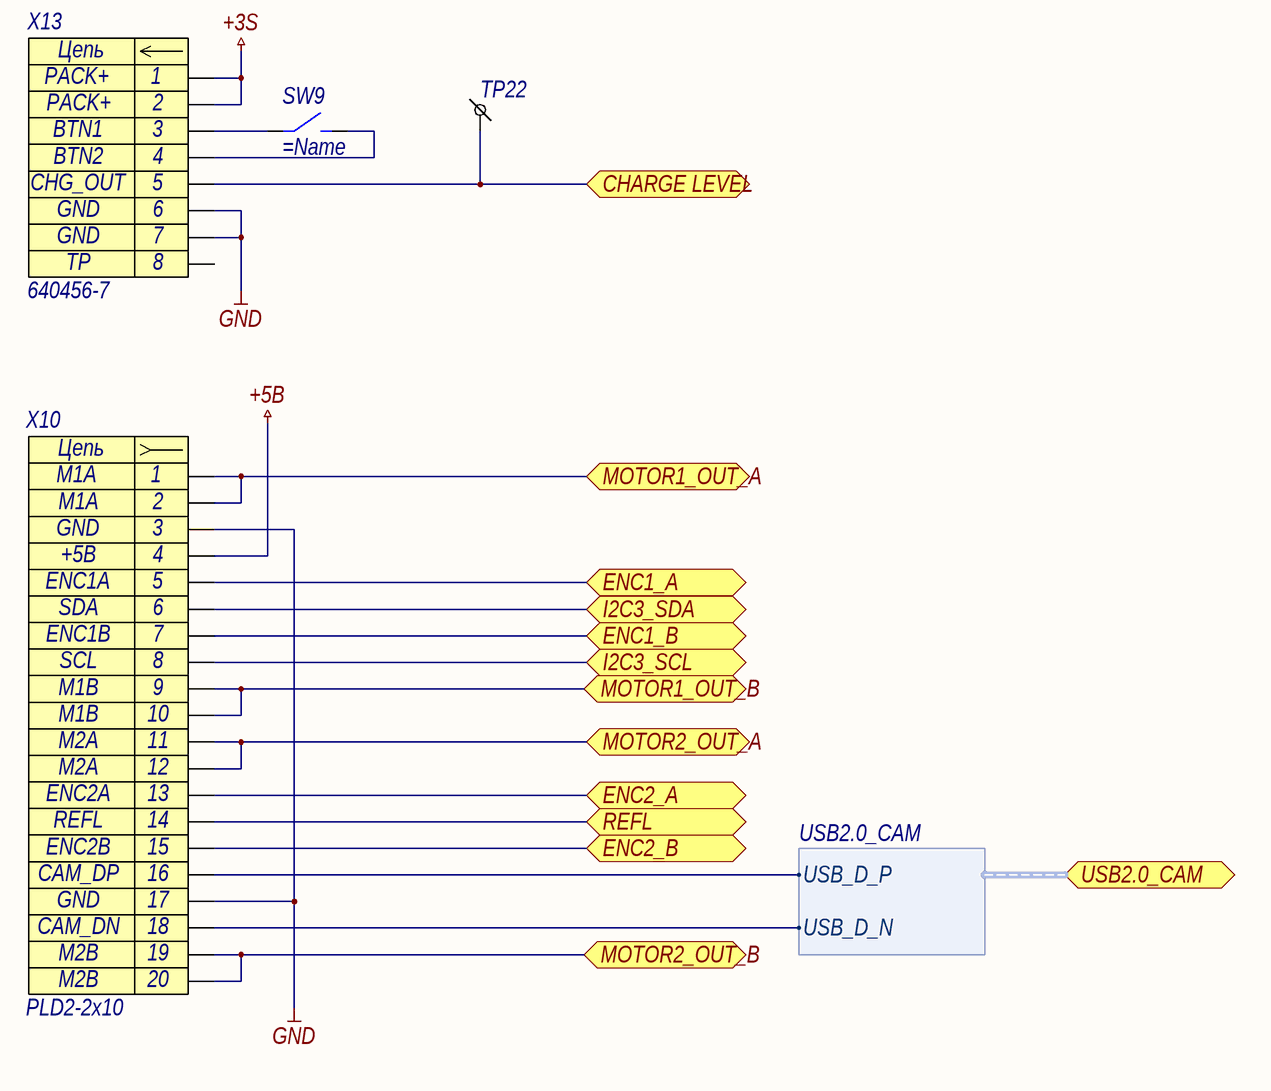
[diagram p10: MB_commutation.SchDoc, bottom right]

### Parts
R40  2,2к  [R0402]
R41  100  [R0402x4]
R42  100  [R0402]
R43  10к  [R0402]
SW9  (no value)  [KTD0621]
TP22  TestPoint  [0.5 x 0,9_round]  (value not drawn)
TP23  TestPoint  [0.5 x 0,9_round]  (value not drawn)
X8  PLS 1.0 1x15  [PLS_1x15 1.0 - without contour]
X9  PLS 1.0 1x15  [PLS_1x15 1.0 - without contour]
X10  PLD2-2x10  [PLS 2.00 10x2]
X11  PicoBlade-8  [PicoBlade-8 fallen]
X12  (no value)  [PLS 4 x 2]
X13  640456-7  [JST-640456-7]

### Ports
+3S (bidir), +5В (bidir), +7,2В (bidir), CAMERA_0 (bidir, harness MIPI CSI0), CAMERA_0_GPIO (bidir, harness CSI0_GPIO), CAMERA_0_I2C (bidir, harness CSI0_I2C), CAMERA_1 (bidir, harness MIPI CSI1), CAMERA_1_I2C (bidir, harness CSI1_I2C), CHARGE LEVEL (bidir), CM5_1,8В (bidir), CM5_3,3В (bidir), ENC1_A (bidir), ENC1_B (bidir), ENC2_A (bidir), ENC2_B (bidir), GND (bidir), I2C3_SCL (bidir), I2C3_SDA (bidir), LED2_DATA (bidir), LiDAR_TX (bidir), MOTOR1_OUT_A (bidir), MOTOR1_OUT_B (bidir), MOTOR2_OUT_A (bidir), MOTOR2_OUT_B (bidir), REFL (bidir), SERVO_LiDAR (bidir, harness IMU  LiDAR STB), SERVO_VYD (bidir), USB2.0 (bidir, harness USB2.0), USB2.0_CAM (bidir, harness USB2.0_CAM)

### Harnesses
IMU  LiDAR STB: SERVO_Y, SERVO_X
CSI0_GPIO: GPIO0, GPIO1
CSI0_I2C: SCL, SDA
CSI1_I2C: SCL, SDA
USB2.0_CAM: USB_D_N, USB_D_P
MIPI CSI1: RX_D0_N, RX_D0_P, RX_D1_N, RX_D1_P, RX_CLK0_N, RX_CLK0_P
MIPI CSI0: RX_D0_N, RX_D0_P, RX_D1_N, RX_D1_P, RX_CLK0_N, RX_CLK0_P
USB2.0: USB_D_N, USB_D_P

### Nets
+3S: X13.1 X13.2 ; port +3S
+5В: X10.4 X11.3 X12.5 ; port +5В
+7,2В: X11.8 X12.1 X12.2 ; port +7,2В
CM5_3,3В: R40.2 R43.2 X8.15 X9.15 ; port CM5_3,3В
GND: X8.1 X8.4 X8.7 X8.10 X9.1 X9.4 X9.7 X9.10 X10.3 X10.17 X11.1 X11.2 X12.7 X12.8 X13.6 X13.7 ; port GND
CHARGE LEVEL: TP22.1 X13.5 ; port CHARGE LEVEL
ENC1_A: X10.5 ; port ENC1_A
ENC1_B: X10.7 ; port ENC1_B
ENC2_A: X10.13 ; port ENC2_A
ENC2_B: X10.15 ; port ENC2_B
I2C3_SCL: X10.8 ; port I2C3_SCL
I2C3_SDA: X10.6 ; port I2C3_SDA
LED2_DATA: R41.6 ; port LED2_DATA
LiDAR_TX: R42.1 R43.1 TP23.1 ; port LiDAR_TX
LiDAR_TX: R42.2 X12.6  [project net LiDAR_TX_6]  [a separate net that carries the same name]
MOTOR1A_OUT: X10.1 X10.2 ; port MOTOR1_OUT_A
MOTOR1B_OUT: X10.9 X10.10 ; port MOTOR1_OUT_B
MOTOR2A_OUT: X10.11 X10.12 ; port MOTOR2_OUT_A
MOTOR2B_OUT: X10.19 X10.20 ; port MOTOR2_OUT_B
REFL: X10.14 ; port REFL
SERVO_VYD: R41.8 ; port SERVO_VYD
NetDD1_36: X9.13 ; port CAMERA_1_I2C.SCL
NetDD1_37: X9.14 ; port CAMERA_1_I2C.SDA
NetDD1_80: X8.13 ; port CAMERA_0_I2C.SCL
NetDD1_82: X8.14 ; port CAMERA_0_I2C.SDA
NetDD1_97: X8.11 ; port CAMERA_0_GPIO.GPIO0
NetDD1_100: X8.12 ; port CAMERA_0_GPIO.GPIO1
NetDD1_115: X8.2 ; port CAMERA_0.RX_D0_N
NetDD1_117: X8.3 ; port CAMERA_0.RX_D0_P
NetDD1_121: X8.5 ; port CAMERA_0.RX_D1_N
NetDD1_123: X8.6 ; port CAMERA_0.RX_D1_P
NetDD1_127: X8.8 ; port CAMERA_0.RX_CLK0_N
NetDD1_129: X8.9 ; port CAMERA_0.RX_CLK0_P
NetDD1_134: X10.16 ; port USB2.0_CAM.USB_D_P
NetDD1_136: X10.18 ; port USB2.0_CAM.USB_D_N
NetDD1_175: X9.2 ; port CAMERA_1.RX_D0_N
NetDD1_177: X9.3 ; port CAMERA_1.RX_D0_P
NetDD1_181: X9.5 ; port CAMERA_1.RX_D1_N
NetDD1_183: X9.6 ; port CAMERA_1.RX_D1_P
NetDD1_187: X9.8 ; port CAMERA_1.RX_CLK0_N
NetDD1_189: X9.9 ; port CAMERA_1.RX_CLK0_P
NetR13_3: X12.3 ; port SERVO_LiDAR.SERVO_X
NetR13_5: X12.4 ; port SERVO_LiDAR.SERVO_Y
NetR40_1: R40.1 X9.11
NetR41_1: R41.1 X11.4
NetR41_2: R41.2 ; port USB2.0.USB_D_N
NetR41_3: R41.3 X11.5
NetR41_4: R41.4 ; port USB2.0.USB_D_P
NetR41_5: R41.5 X11.6
NetR41_7: R41.7 X11.7
NetSW9_1: SW9.1 X13.3
NetSW9_2: SW9.2 X13.4

Not connected (* = marked no-connect by the designer): X9 12; X13 0

### Notes on the sheet
- Хочу крутые шлейфа с уменьшением шага
- Подп. и дата
- Инв. № дубл.
- Взам. инв. №
- Инв. № подл.
- Лист
- Изм.
- № докум.
- Подп.
- Дата
- Копировал
- Формат
- А2
- (in symbol Header_7_fth) Цепь; 8
- (in symbol Header_8) Цепь
- (in symbol Header_15) Цепь
- (in symbol PLS 10 x 2) Цепь

### Library data of the parts
R40 R42 R43 = Резистор 0.05Вт: Резистор 0,05Вт
  R40: Value: 2,2к
  R42: Value: 100
  R43: Value: 10к
R41 = Резисторная сборка 0.05 x 4: Value: 100
SW9 = button
X8 X9 = Header_15: Разъем - 15 конт. папа; Contact_1: GND; Contact_2: RX_D0N; Contact_3: RX_D0P; Contact_5: RX_D1N; Contact_6: RX_D1P; Contact_8: RX_CLKON; Contact_9: RX_CLKOP; Contact_11: CAM_IO0; Contact_12: CAM_IO1; Contact_13: SCL; Contact_14: SDA; Contact_15: +3,3В; Contact_4: GND; Contact_7: GND; Contact_10: GND; Name: PLS 1.0 1x15
X10 = PLS 10 x 2: Contact_1: M1A; Contact_3: GND; Contact_4: +5В; Contact_5: ENC1A; Contact_6: SDA; Contact_7: ENC1B; Contact_8: SCL; Contact_9: M1B; Contact_11: M2A; Contact_13: ENC2A; Contact_14: REFL; Contact_15: ENC2B; Contact_16: CAM_DP; Contact_18: CAM_DN; Contact_19: M2B; Contact_2: M1A; Contact_10: M1B; Contact_12: M2A; Contact_17: GND; Contact_20: M2B; Name: PLD2-2x10
X11 = Header_8: Разъем - 8 конт. мама; Contact_1: GND; Contact_3: +5В; Contact_4: DN; Contact_5: DP; Contact_6: LED_DATA; Contact_7: SERVO_DATA; Contact_8: +7,2В; Contact_2: GND; Name: PicoBlade-8
X12 = Header_8: Разъем - 8 конт. мама; Contact_1: +7,2В; Contact_3: SERVO_X; Contact_4: SERVO_Y; Contact_5: +5В; Contact_6: LiDAR_TX; Contact_7: GND; Contact_2: +7,2В; Contact_8: GND
X13 = Header_7_fth: Разъем - 7 конт. папа; Contact_1: PACK+; Contact_3: BTN1; Contact_4: BTN2; Contact_5: CHG_OUT; Contact_6: GND; Contact_8: TP; Contact_2: PACK+; Contact_7: GND; Name: 640456-7